# EAGLE schematic bms_108_Cell (EAGLE 6.2), part 1 of 2

## Sheet 1 of 9
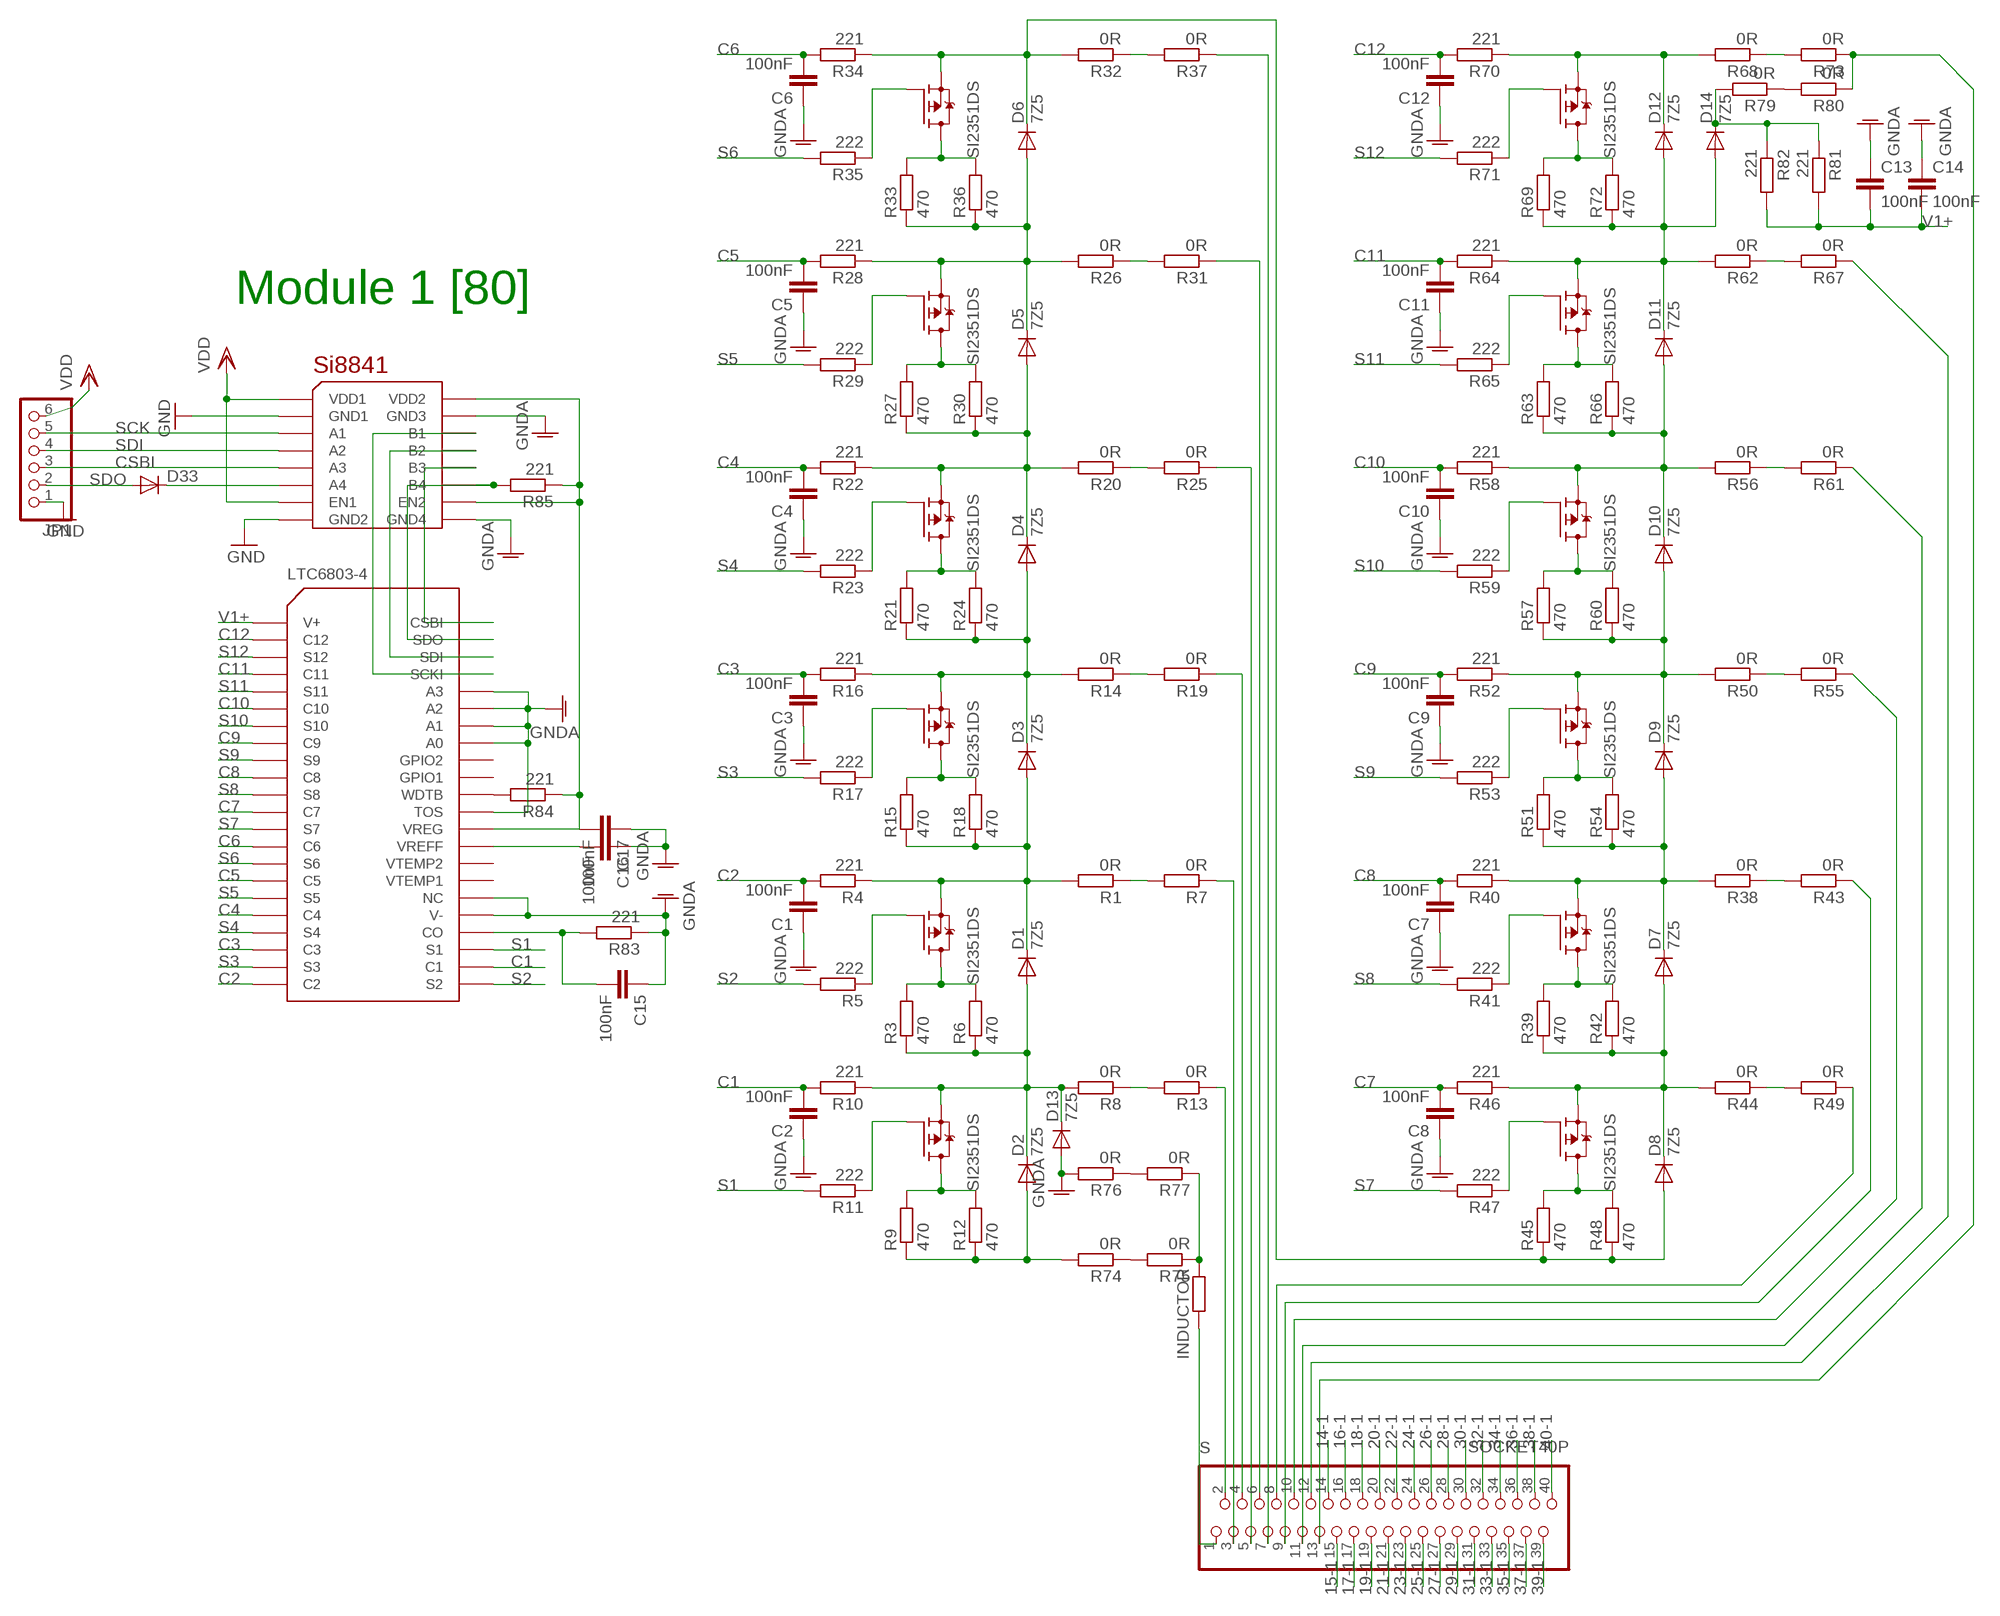
[diagram p0: schematic, sheet 1]

### Parts
C1  100nF  C-EUC0805K  [C0805K]
C2  100nF  C-EUC0805K  [C0805K]
C3  100nF  C-EUC0805K  [C0805K]
C4  100nF  C-EUC0805K  [C0805K]
C5  100nF  C-EUC0805K  [C0805K]
C6  100nF  C-EUC0805K  [C0805K]
C7  100nF  C-EUC0805K  [C0805K]
C8  100nF  C-EUC0805K  [C0805K]
C9  100nF  C-EUC0805K  [C0805K]
C10  100nF  C-EUC0805K  [C0805K]
C11  100nF  C-EUC0805K  [C0805K]
C12  100nF  C-EUC0805K  [C0805K]
C13  100nF  C-EUC0805K  [C0805K]
C14  100nF  C-EUC0805K  [C0805K]
C15  100nF  C-EUC0805K  [C0805K]
C16  100nF  C-EUC0805K  [C0805K]
C17  100nF  C-EUC0805K  [C0805K]
D1  7Z5  DIODE-SMB  [SMB]
D2  7Z5  DIODE-SMB  [SMB]
D3  7Z5  DIODE-SMB  [SMB]
D4  7Z5  DIODE-SMB  [SMB]
D5  7Z5  DIODE-SMB  [SMB]
D6  7Z5  DIODE-SMB  [SMB]
D7  7Z5  DIODE-SMB  [SMB]
D8  7Z5  DIODE-SMB  [SMB]
D9  7Z5  DIODE-SMB  [SMB]
D10  7Z5  DIODE-SMB  [SMB]
D11  7Z5  DIODE-SMB  [SMB]
D12  7Z5  DIODE-SMB  [SMB]
D13  7Z5  DIODE-SMB  [SMB]
D14  7Z5  DIODE-SMB  [SMB]
D33  DIODE-SOD123  [SOD123]
JP1  PINHD-1X6  [1X06]
R1  0R  R-EU_M1206  [M1206]
R3  470  R-EU_R6332  [R6332]
R4  221  R-EU_R0805  [R0805]
R5  222  R-EU_R0805  [R0805]
R6  470  R-EU_R6332  [R6332]
R7  0R  R-EU_M1206  [M1206]
R8  0R  R-EU_M1206  [M1206]
R9  470  R-EU_R6332  [R6332]
R10  221  R-EU_R0805  [R0805]
R11  222  R-EU_R0805  [R0805]
R12  470  R-EU_R6332  [R6332]
R13  0R  R-EU_M1206  [M1206]
R14  0R  R-EU_M1206  [M1206]
R15  470  R-EU_R6332  [R6332]
R16  221  R-EU_R0805  [R0805]
R17  222  R-EU_R0805  [R0805]
R18  470  R-EU_R6332  [R6332]
R19  0R  R-EU_M1206  [M1206]
R20  0R  R-EU_M1206  [M1206]
R21  470  R-EU_R6332  [R6332]
R22  221  R-EU_R0805  [R0805]
R23  222  R-EU_R0805  [R0805]
R24  470  R-EU_R6332  [R6332]
R25  0R  R-EU_M1206  [M1206]
R26  0R  R-EU_M1206  [M1206]
R27  470  R-EU_R6332  [R6332]
R28  221  R-EU_R0805  [R0805]
R29  222  R-EU_R0805  [R0805]
R30  470  R-EU_R6332  [R6332]
R31  0R  R-EU_M1206  [M1206]
R32  0R  R-EU_M1206  [M1206]
R33  470  R-EU_R6332  [R6332]
R34  221  R-EU_R0805  [R0805]
R35  222  R-EU_R0805  [R0805]
R36  470  R-EU_R6332  [R6332]
R37  0R  R-EU_M1206  [M1206]
R38  0R  R-EU_M1206  [M1206]
R39  470  R-EU_R6332  [R6332]
R40  221  R-EU_R0805  [R0805]
R41  222  R-EU_R0805  [R0805]
R42  470  R-EU_R6332  [R6332]
R43  0R  R-EU_M1206  [M1206]
R44  0R  R-EU_M1206  [M1206]
R45  470  R-EU_R6332  [R6332]
R46  221  R-EU_R0805  [R0805]
R47  222  R-EU_R0805  [R0805]
R48  470  R-EU_R6332  [R6332]
R49  0R  R-EU_M1206  [M1206]
R50  0R  R-EU_M1206  [M1206]
R51  470  R-EU_R6332  [R6332]
R52  221  R-EU_R0805  [R0805]
R53  222  R-EU_R0805  [R0805]
R54  470  R-EU_R6332  [R6332]
R55  0R  R-EU_M1206  [M1206]
R56  0R  R-EU_M1206  [M1206]
R57  470  R-EU_R6332  [R6332]
R58  221  R-EU_R0805  [R0805]
R59  222  R-EU_R0805  [R0805]
R60  470  R-EU_R6332  [R6332]
R61  0R  R-EU_M1206  [M1206]
R62  0R  R-EU_M1206  [M1206]
R63  470  R-EU_R6332  [R6332]
R64  221  R-EU_R0805  [R0805]
R65  222  R-EU_R0805  [R0805]
R66  470  R-EU_R6332  [R6332]
R67  0R  R-EU_M1206  [M1206]
R68  0R  R-EU_M1206  [M1206]
R69  470  R-EU_R6332  [R6332]
R70  221  R-EU_R0805  [R0805]
R71  222  R-EU_R0805  [R0805]
R72  470  R-EU_R6332  [R6332]
R73  0R  R-EU_M1206  [M1206]
R74  0R  R-EU_M1206  [M1206]
R75  0R  R-EU_M1206  [M1206]
R76  0R  R-EU_M1206  [M1206]
R77  0R  R-EU_M1206  [M1206]
R79  0R  R-EU_M1206  [M1206]
R80  0R  R-EU_M1206  [M1206]
R81  221  R-EU_R0805  [R0805]
R82  221  R-EU_R0805  [R0805]
R83  221  R-EU_R0805  [R0805]
R84  221  R-EU_R0805  [R0805]
R85  221  R-EU_R0805  [R0805]
S  SOCKET40P  [40PIN]
U$1  LTC6803-4  [SSOP44]
U$2  SI8841  [SO16]
U$3  SI2351DS  [SOT23]
U$4  SI2351DS  [SOT23]
U$5  SI2351DS  [SOT23]
U$6  SI2351DS  [SOT23]
U$7  SI2351DS  [SOT23]
U$8  SI2351DS  [SOT23]
U$9  SI2351DS  [SOT23]
U$10  SI2351DS  [SOT23]
U$11  SI2351DS  [SOT23]
U$12  SI2351DS  [SOT23]
U$13  SI2351DS  [SOT23]
U$14  SI2351DS  [SOT23]
U$15  INDUCTOR  [L2012C]

### Nets
14-1: S.14 ; also sheet 2
15-1: S.15 ; also sheet 2
16-1: S.16 ; also sheet 2
17-1: S.17 ; also sheet 2
18-1: S.18 ; also sheet 2
19-1: S.19 ; also sheet 2
20-1: S.20 ; also sheet 2
21-1: S.21 ; also sheet 2
22-1: S.22 ; also sheet 2
23-1: S.23 ; also sheet 2
24-1: S.24 ; also sheet 2
25-1: S.25 ; also sheet 2
26-1: S.26 ; also sheet 2
27-1: S.27
28-1: S.28 ; also sheet 3
29-1: S.29 ; also sheet 3
30-1: S.30 ; also sheet 3
31-1: S.31 ; also sheet 3
32-1: S.32 ; also sheet 3
33-1: S.33 ; also sheet 3
34-1: S.34 ; also sheet 3
35-1: S.35 ; also sheet 3
36-1: S.36 ; also sheet 3
37-1: S.37 ; also sheet 3
38-1: S.38 ; also sheet 3
39-1: S.39 ; also sheet 3
40-1: S.40 ; also sheet 3
C1: C2.2 R10.2 U$1.24(C1)
C2: C1.2 R4.2 U$1.P$22(C2)
C3: C3.2 R16.2 U$1.P$20(C3)
C4: C4.2 R22.2 U$1.P$18(C4)
C5: C5.2 R28.2 U$1.P$16(C5)
C6: C6.2 R34.2 U$1.P$14(C6)
C7: C8.2 R46.2 U$1.P$12(C7)
C8: C7.2 R40.2 U$1.P$10(C8)
C9: C9.2 R52.2 U$1.P$8(C9)
C10: C10.2 R58.2 U$1.P$6(C10)
C11: C11.2 R64.2 U$1.P$4(C11)
C12: C12.2 R70.2 U$1.P$2(C12)
CSBI: JP1.3 U$2.5(A3) ; also sheet 2,3,4,5,6,7,8,9
GND: JP1.1 U$2.2(GND1) U$2.8(GND2) ; also sheet 2,3,4,5,6,7,8,9
GNDA: C1.1 C2.1 C3.1 C4.1 C5.1 C6.1 C7.1 C8.1 C9.1 C10.1 C11.1 C12.1 C13.1 C14.1 C15.1 C16.1 C17.1 D13.A R76.2 R83.1 U$1.27(V-) U$1.28(NC) U$1.33(TOS) U$1.37(A0) U$1.38(A1) U$1.39(A2) U$1.40(A3) U$2.9(GND4) U$2.15(GND3)
N$1: R5.1 U$3.1(G)
N$2: R74.1 R75.2
N$3: R3.2 R6.2 U$3.3(D)
N$4: D1.A D2.C D13.C R3.1 R6.1 R8.2 R10.1 U$4.2(S)
N$5: R41.1 U$9.1(G)
N$6: R29.1 U$7.1(G)
N$7: R23.1 U$6.1(G)
N$8: R21.2 R24.2 U$6.3(D)
N$9: R1.1 R7.2
N$10: R11.1 U$4.1(G)
N$11: R9.2 R12.2 U$4.3(D)
N$12: R76.1 R77.2
N$13: D3.C D4.A R14.2 R16.1 R21.1 R24.1 U$5.2(S)
N$14: R8.1 R13.2
N$15: R27.2 R30.2 U$7.3(D)
N$16: R17.1 U$5.1(G)
N$17: R15.2 R18.2 U$5.3(D)
N$18: D1.C D3.A R1.2 R4.1 R15.1 R18.1 U$3.2(S)
N$19: R20.1 R25.2
N$20: R14.1 R19.2
N$21: D4.C D5.A R20.2 R22.1 R27.1 R30.1 U$6.2(S)
N$22: R26.1 R31.2
N$23: R75.1 R77.1 U$15.1
N$24: R35.1 U$8.1(G)
N$25: R33.2 R36.2 U$8.3(D)
N$26: D5.C D6.A R26.2 R28.1 R33.1 R36.1 U$7.2(S)
N$27: R32.1 R37.2
N$28: R39.2 R42.2 U$9.3(D)
N$29: D7.A D8.C R39.1 R42.1 R44.2 R46.1 U$10.2(S)
N$30: R38.1 R43.2
N$31: R47.1 U$10.1(G)
N$32: R45.2 R48.2 U$10.3(D)
N$33: D6.C D8.A R32.2 R34.1 R45.1 R48.1 U$8.2(S)
N$34: R44.1 R49.2
N$35: R53.1 U$11.1(G)
N$36: R51.2 R54.2 U$11.3(D)
N$37: D7.C D9.A R38.2 R40.1 R51.1 R54.1 U$9.2(S)
N$38: R50.1 R55.2
N$39: D2.A R9.1 R12.1 R74.2
N$40: R59.1 U$12.1(G)
N$41: R57.2 R60.2 U$12.3(D)
N$42: D9.C D10.A R50.2 R52.1 R57.1 R60.1 U$11.2(S)
N$43: R56.1 R61.2
N$44: R65.1 U$13.1(G)
N$45: R63.2 R66.2 U$13.3(D)
N$46: D10.C D11.A R56.2 R58.1 R63.1 R66.1 U$12.2(S)
N$47: R62.1 R67.2
N$48: D12.C R68.2 R70.1 U$14.2(S)
N$49: R71.1 U$14.1(G)
N$50: R69.2 R72.2 U$14.3(D)
N$51: D11.C D12.A D14.A R62.2 R64.1 R69.1 R72.1 U$13.2(S)
N$52: R68.1 R73.2
N$53: R85.2 U$1.43(SDO) U$2.11(B4)
N$55: R79.1 R80.2
N$56: C15.2 R83.2 U$1.26(CO)
N$57: D14.C R79.2 R81.1 R82.1
N$58: R73.1 R80.1 S.13
N$59: C16.2 U$1.31(VREFF)
N$60: C17.2 R84.1 R85.1 U$1.32(VREG) U$2.10(EN2) U$2.16(VDD2)
N$61: U$1.41(SCKI) U$2.14(B1)
N$62: R84.2 U$1.34(WDTB)
N$63: U$1.44(CSBI) U$2.12(B3)
N$64: U$1.42(SDI) U$2.13(B2)
N$65: S.1 U$15.2
N$66: R13.1 S.2
N$67: R7.1 S.3
N$68: R19.1 S.4
N$69: R25.1 S.5
N$70: R31.1 S.6
N$71: R37.1 S.7
N$72: R49.1 S.8
N$73: R43.1 S.9
N$74: R55.1 S.10
N$75: R61.1 S.11
N$76: R67.1 S.12
N$159: D33.C U$2.6(A4)
S1: R11.2 U$1.25(S1)
S2: R5.2 U$1.23(S2)
S3: R17.2 U$1.P$21(S3)
S4: R23.2 U$1.P$19(S4)
S5: R29.2 U$1.P$17(S5)
S6: R35.2 U$1.P$15(S6)
S7: R47.2 U$1.P$13(S7)
S8: R41.2 U$1.P$11(S8)
S9: R53.2 U$1.P$9(S9)
S10: R59.2 U$1.P$7(S10)
S11: R65.2 U$1.P$5(S11)
S12: R71.2 U$1.P$3(S12)
SCK: JP1.5 U$2.3(A1) ; also sheet 2,3,4,5,6,7,8,9
SDI: JP1.4 U$2.4(A2) ; also sheet 2,3,4,5,6,7,8,9
SDO: D33.A JP1.2 ; also sheet 2,3,4,5,6,7,8,9
V1+: C13.2 C14.2 R81.2 R82.2 U$1.P$1(V+)
VDD: JP1.6 U$2.1(VDD1) U$2.7(EN1) ; also sheet 2,3,4,5,6,7,8,9
Unconnected: U$1.29(VTEMP1) U$1.30(VTEMP2) U$1.35(GPIO1) U$1.36(GPIO2)

### Notes on the sheet
- Module 1 [80]

## Sheet 2 of 9
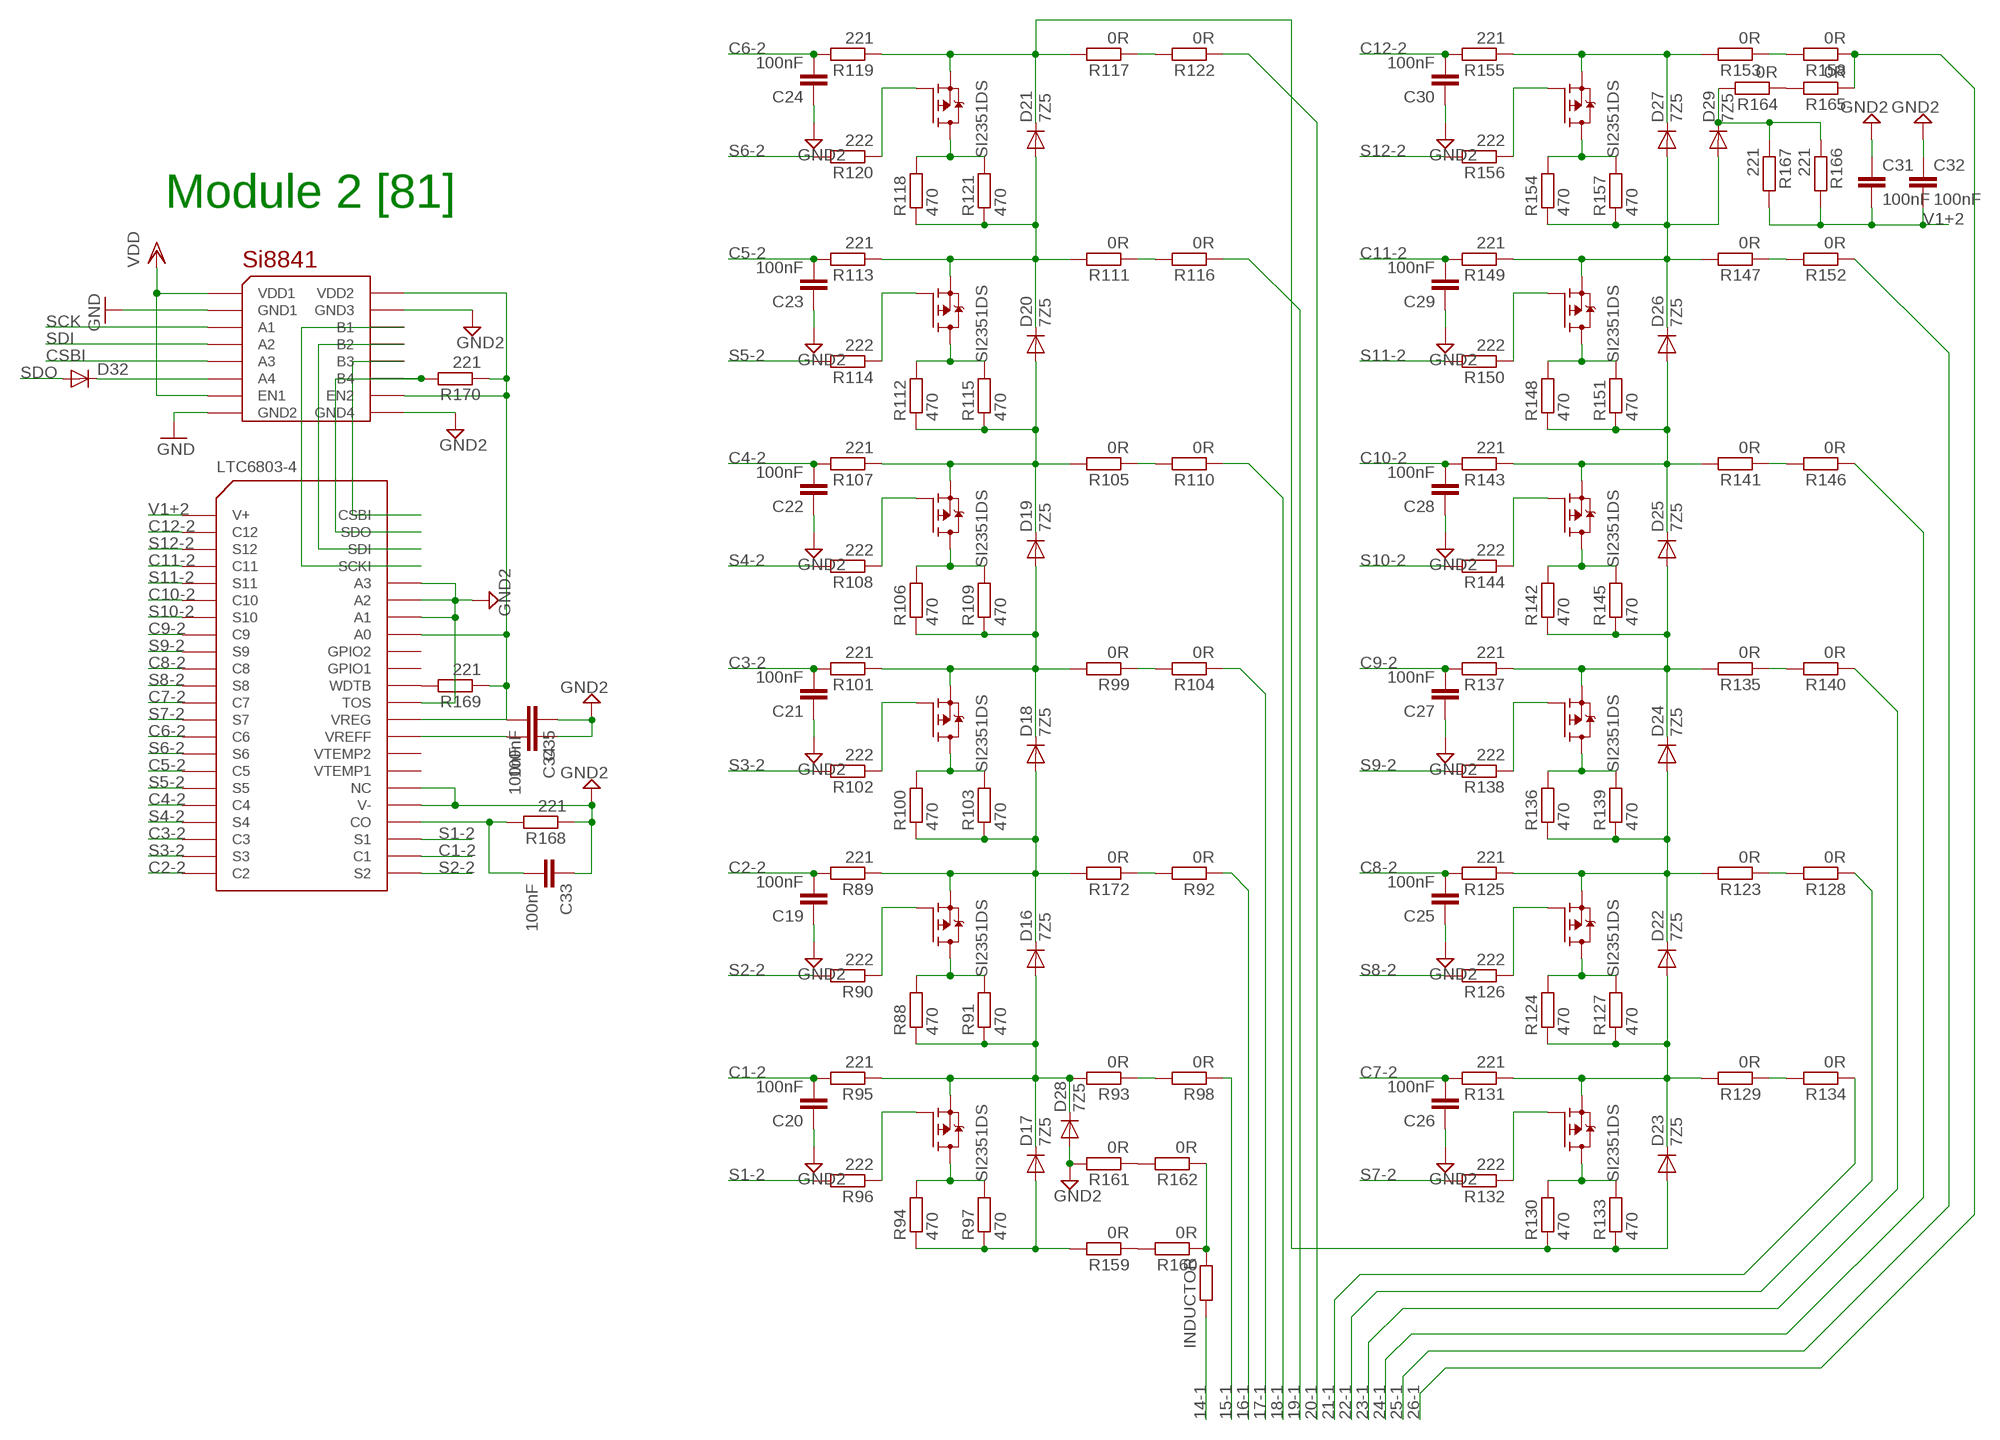
[diagram p1: schematic, sheet 2]

### Parts
C19  100nF  C-EUC0805K  [C0805K]
C20  100nF  C-EUC0805K  [C0805K]
C21  100nF  C-EUC0805K  [C0805K]
C22  100nF  C-EUC0805K  [C0805K]
C23  100nF  C-EUC0805K  [C0805K]
C24  100nF  C-EUC0805K  [C0805K]
C25  100nF  C-EUC0805K  [C0805K]
C26  100nF  C-EUC0805K  [C0805K]
C27  100nF  C-EUC0805K  [C0805K]
C28  100nF  C-EUC0805K  [C0805K]
C29  100nF  C-EUC0805K  [C0805K]
C30  100nF  C-EUC0805K  [C0805K]
C31  100nF  C-EUC0805K  [C0805K]
C32  100nF  C-EUC0805K  [C0805K]
C33  100nF  C-EUC0805K  [C0805K]
C34  100nF  C-EUC0805K  [C0805K]
C35  100nF  C-EUC0805K  [C0805K]
D16  7Z5  DIODE-SMB  [SMB]
D17  7Z5  DIODE-SMB  [SMB]
D18  7Z5  DIODE-SMB  [SMB]
D19  7Z5  DIODE-SMB  [SMB]
D20  7Z5  DIODE-SMB  [SMB]
D21  7Z5  DIODE-SMB  [SMB]
D22  7Z5  DIODE-SMB  [SMB]
D23  7Z5  DIODE-SMB  [SMB]
D24  7Z5  DIODE-SMB  [SMB]
D25  7Z5  DIODE-SMB  [SMB]
D26  7Z5  DIODE-SMB  [SMB]
D27  7Z5  DIODE-SMB  [SMB]
D28  7Z5  DIODE-SMB  [SMB]
D29  7Z5  DIODE-SMB  [SMB]
D32  DIODE-SOD123  [SOD123]
R88  470  R-EU_R6332  [R6332]
R89  221  R-EU_R0805  [R0805]
R90  222  R-EU_R0805  [R0805]
R91  470  R-EU_R6332  [R6332]
R92  0R  R-EU_M1206  [M1206]
R93  0R  R-EU_M1206  [M1206]
R94  470  R-EU_R6332  [R6332]
R95  221  R-EU_R0805  [R0805]
R96  222  R-EU_R0805  [R0805]
R97  470  R-EU_R6332  [R6332]
R98  0R  R-EU_M1206  [M1206]
R99  0R  R-EU_M1206  [M1206]
R100  470  R-EU_R6332  [R6332]
R101  221  R-EU_R0805  [R0805]
R102  222  R-EU_R0805  [R0805]
R103  470  R-EU_R6332  [R6332]
R104  0R  R-EU_M1206  [M1206]
R105  0R  R-EU_M1206  [M1206]
R106  470  R-EU_R6332  [R6332]
R107  221  R-EU_R0805  [R0805]
R108  222  R-EU_R0805  [R0805]
R109  470  R-EU_R6332  [R6332]
R110  0R  R-EU_M1206  [M1206]
R111  0R  R-EU_M1206  [M1206]
R112  470  R-EU_R6332  [R6332]
R113  221  R-EU_R0805  [R0805]
R114  222  R-EU_R0805  [R0805]
R115  470  R-EU_R6332  [R6332]
R116  0R  R-EU_M1206  [M1206]
R117  0R  R-EU_M1206  [M1206]
R118  470  R-EU_R6332  [R6332]
R119  221  R-EU_R0805  [R0805]
R120  222  R-EU_R0805  [R0805]
R121  470  R-EU_R6332  [R6332]
R122  0R  R-EU_M1206  [M1206]
R123  0R  R-EU_M1206  [M1206]
R124  470  R-EU_R6332  [R6332]
R125  221  R-EU_R0805  [R0805]
R126  222  R-EU_R0805  [R0805]
R127  470  R-EU_R6332  [R6332]
R128  0R  R-EU_M1206  [M1206]
R129  0R  R-EU_M1206  [M1206]
R130  470  R-EU_R6332  [R6332]
R131  221  R-EU_R0805  [R0805]
R132  222  R-EU_R0805  [R0805]
R133  470  R-EU_R6332  [R6332]
R134  0R  R-EU_M1206  [M1206]
R135  0R  R-EU_M1206  [M1206]
R136  470  R-EU_R6332  [R6332]
R137  221  R-EU_R0805  [R0805]
R138  222  R-EU_R0805  [R0805]
R139  470  R-EU_R6332  [R6332]
R140  0R  R-EU_M1206  [M1206]
R141  0R  R-EU_M1206  [M1206]
R142  470  R-EU_R6332  [R6332]
R143  221  R-EU_R0805  [R0805]
R144  222  R-EU_R0805  [R0805]
R145  470  R-EU_R6332  [R6332]
R146  0R  R-EU_M1206  [M1206]
R147  0R  R-EU_M1206  [M1206]
R148  470  R-EU_R6332  [R6332]
R149  221  R-EU_R0805  [R0805]
R150  222  R-EU_R0805  [R0805]
R151  470  R-EU_R6332  [R6332]
R152  0R  R-EU_M1206  [M1206]
R153  0R  R-EU_M1206  [M1206]
R154  470  R-EU_R6332  [R6332]
R155  221  R-EU_R0805  [R0805]
R156  222  R-EU_R0805  [R0805]
R157  470  R-EU_R6332  [R6332]
R158  0R  R-EU_M1206  [M1206]
R159  0R  R-EU_M1206  [M1206]
R160  0R  R-EU_M1206  [M1206]
R161  0R  R-EU_M1206  [M1206]
R162  0R  R-EU_M1206  [M1206]
R164  0R  R-EU_M1206  [M1206]
R165  0R  R-EU_M1206  [M1206]
R166  221  R-EU_R0805  [R0805]
R167  221  R-EU_R0805  [R0805]
R168  221  R-EU_R0805  [R0805]
R169  221  R-EU_R0805  [R0805]
R170  221  R-EU_R0805  [R0805]
R172  0R  R-EU_M1206  [M1206]
U$16  LTC6803-4  [SSOP44]
U$17  SI8841  [SO16]
U$18  SI2351DS  [SOT23]
U$19  SI2351DS  [SOT23]
U$20  SI2351DS  [SOT23]
U$21  SI2351DS  [SOT23]
U$22  SI2351DS  [SOT23]
U$23  SI2351DS  [SOT23]
U$24  SI2351DS  [SOT23]
U$25  SI2351DS  [SOT23]
U$26  SI2351DS  [SOT23]
U$27  SI2351DS  [SOT23]
U$28  SI2351DS  [SOT23]
U$29  SI2351DS  [SOT23]
U$30  INDUCTOR  [L2012C]

### Nets
14-1: U$30.2 ; also sheet 1
15-1: R98.1 ; also sheet 1
16-1: R92.1 ; also sheet 1
17-1: R104.1 ; also sheet 1
18-1: R110.1 ; also sheet 1
19-1: R116.1 ; also sheet 1
20-1: R122.1 ; also sheet 1
21-1: R134.1 ; also sheet 1
22-1: R128.1 ; also sheet 1
23-1: R140.1 ; also sheet 1
24-1: R146.1 ; also sheet 1
25-1: R152.1 ; also sheet 1
26-1: R158.1 R165.1 ; also sheet 1
C1-2: C20.2 R95.2 U$16.24(C1)
C2-2: C19.2 R89.2 U$16.P$22(C2)
C3-2: C21.2 R101.2 U$16.P$20(C3)
C4-2: C22.2 R107.2 U$16.P$18(C4)
C5-2: C23.2 R113.2 U$16.P$16(C5)
C6-2: C24.2 R119.2 U$16.P$14(C6)
C7-2: C26.2 R131.2 U$16.P$12(C7)
C8-2: C25.2 R125.2 U$16.P$10(C8)
C9-2: C27.2 R137.2 U$16.P$8(C9)
C10-2: C28.2 R143.2 U$16.P$6(C10)
C11-2: C29.2 R149.2 U$16.P$4(C11)
C12-2: C30.2 R155.2 U$16.P$2(C12)
CSBI: U$17.5(A3) ; also sheet 1,3,4,5,6,7,8,9
GND: U$17.2(GND1) U$17.8(GND2) ; also sheet 1,3,4,5,6,7,8,9
GND2: C19.1 C20.1 C21.1 C22.1 C23.1 C24.1 C25.1 C26.1 C27.1 C28.1 C29.1 C30.1 C31.1 C32.1 C33.1 C34.1 C35.1 D28.A R161.2 R168.1 U$16.27(V-) U$16.28(NC) U$16.33(TOS) U$16.38(A1) U$16.39(A2) U$16.40(A3) U$17.9(GND4) U$17.15(GND3)
N$77: R90.1 U$18.1(G)
N$78: R88.2 R91.2 U$18.3(D)
N$79: D16.A D17.C D28.C R88.1 R91.1 R93.2 R95.1 U$19.2(S)
N$80: R92.2 R172.1
N$81: R96.1 U$19.1(G)
N$82: R94.2 R97.2 U$19.3(D)
N$83: R93.1 R98.2
N$84: R102.1 U$20.1(G)
N$85: R100.2 R103.2 U$20.3(D)
N$86: D16.C D18.A R89.1 R100.1 R103.1 R172.2 U$18.2(S)
N$87: R99.1 R104.2
N$88: R108.1 U$21.1(G)
N$89: R106.2 R109.2 U$21.3(D)
N$90: D18.C D19.A R99.2 R101.1 R106.1 R109.1 U$20.2(S)
N$91: R105.1 R110.2
N$92: R114.1 U$22.1(G)
N$93: R112.2 R115.2 U$22.3(D)
N$94: D19.C D20.A R105.2 R107.1 R112.1 R115.1 U$21.2(S)
N$95: R111.1 R116.2
N$96: R120.1 U$23.1(G)
N$97: R118.2 R121.2 U$23.3(D)
N$98: D20.C D21.A R111.2 R113.1 R118.1 R121.1 U$22.2(S)
N$99: R117.1 R122.2
N$100: R126.1 U$24.1(G)
N$101: R124.2 R127.2 U$24.3(D)
N$102: D22.A D23.C R124.1 R127.1 R129.2 R131.1 U$25.2(S)
N$103: R123.1 R128.2
N$104: R132.1 U$25.1(G)
N$105: R130.2 R133.2 U$25.3(D)
N$106: D21.C D23.A R117.2 R119.1 R130.1 R133.1 U$23.2(S)
N$107: R129.1 R134.2
N$108: R138.1 U$26.1(G)
N$109: R136.2 R139.2 U$26.3(D)
N$110: D22.C D24.A R123.2 R125.1 R136.1 R139.1 U$24.2(S)
N$111: R135.1 R140.2
N$112: R144.1 U$27.1(G)
N$113: R142.2 R145.2 U$27.3(D)
N$114: D24.C D25.A R135.2 R137.1 R142.1 R145.1 U$26.2(S)
N$115: R141.1 R146.2
N$116: R150.1 U$28.1(G)
N$117: R148.2 R151.2 U$28.3(D)
N$118: D25.C D26.A R141.2 R143.1 R148.1 R151.1 U$27.2(S)
N$119: R147.1 R152.2
N$120: D27.C R153.2 R155.1 U$29.2(S)
N$121: R156.1 U$29.1(G)
N$122: R154.2 R157.2 U$29.3(D)
N$123: D26.C D27.A D29.A R147.2 R149.1 R154.1 R157.1 U$28.2(S)
N$124: R153.1 R158.2
N$125: R159.1 R160.2
N$126: R160.1 R162.1 U$30.1
N$127: D17.A R94.1 R97.1 R159.2
N$128: R161.1 R162.2
N$130: R164.1 R165.2
N$131: D29.C R164.2 R166.1 R167.1
N$133: C33.2 R168.2 U$16.26(CO)
N$134: C34.2 U$16.31(VREFF)
N$135: C35.2 R169.1 R170.1 U$16.32(VREG) U$16.37(A0) U$17.10(EN2) U$17.16(VDD2)
N$136: R169.2 U$16.34(WDTB)
N$137: R170.2 U$16.43(SDO) U$17.11(B4)
N$138: U$16.44(CSBI) U$17.12(B3)
N$139: U$16.42(SDI) U$17.13(B2)
N$140: U$16.41(SCKI) U$17.14(B1)
N$153: D32.C U$17.6(A4)
S1-2: R96.2 U$16.25(S1)
S2-2: R90.2 U$16.23(S2)
S3-2: R102.2 U$16.P$21(S3)
S4-2: R108.2 U$16.P$19(S4)
S5-2: R114.2 U$16.P$17(S5)
S6-2: R120.2 U$16.P$15(S6)
S7-2: R132.2 U$16.P$13(S7)
S8-2: R126.2 U$16.P$11(S8)
S9-2: R138.2 U$16.P$9(S9)
S10-2: R144.2 U$16.P$7(S10)
S11-2: R150.2 U$16.P$5(S11)
S12-2: R156.2 U$16.P$3(S12)
SCK: U$17.3(A1) ; also sheet 1,3,4,5,6,7,8,9
SDI: U$17.4(A2) ; also sheet 1,3,4,5,6,7,8,9
SDO: D32.A ; also sheet 1,3,4,5,6,7,8,9
V1+2: C31.2 C32.2 R166.2 R167.2 U$16.P$1(V+)
VDD: U$17.1(VDD1) U$17.7(EN1) ; also sheet 1,3,4,5,6,7,8,9
Unconnected: U$16.29(VTEMP1) U$16.30(VTEMP2) U$16.35(GPIO1) U$16.36(GPIO2)

### Notes on the sheet
- Module 2 [81]

## Sheet 3 of 9
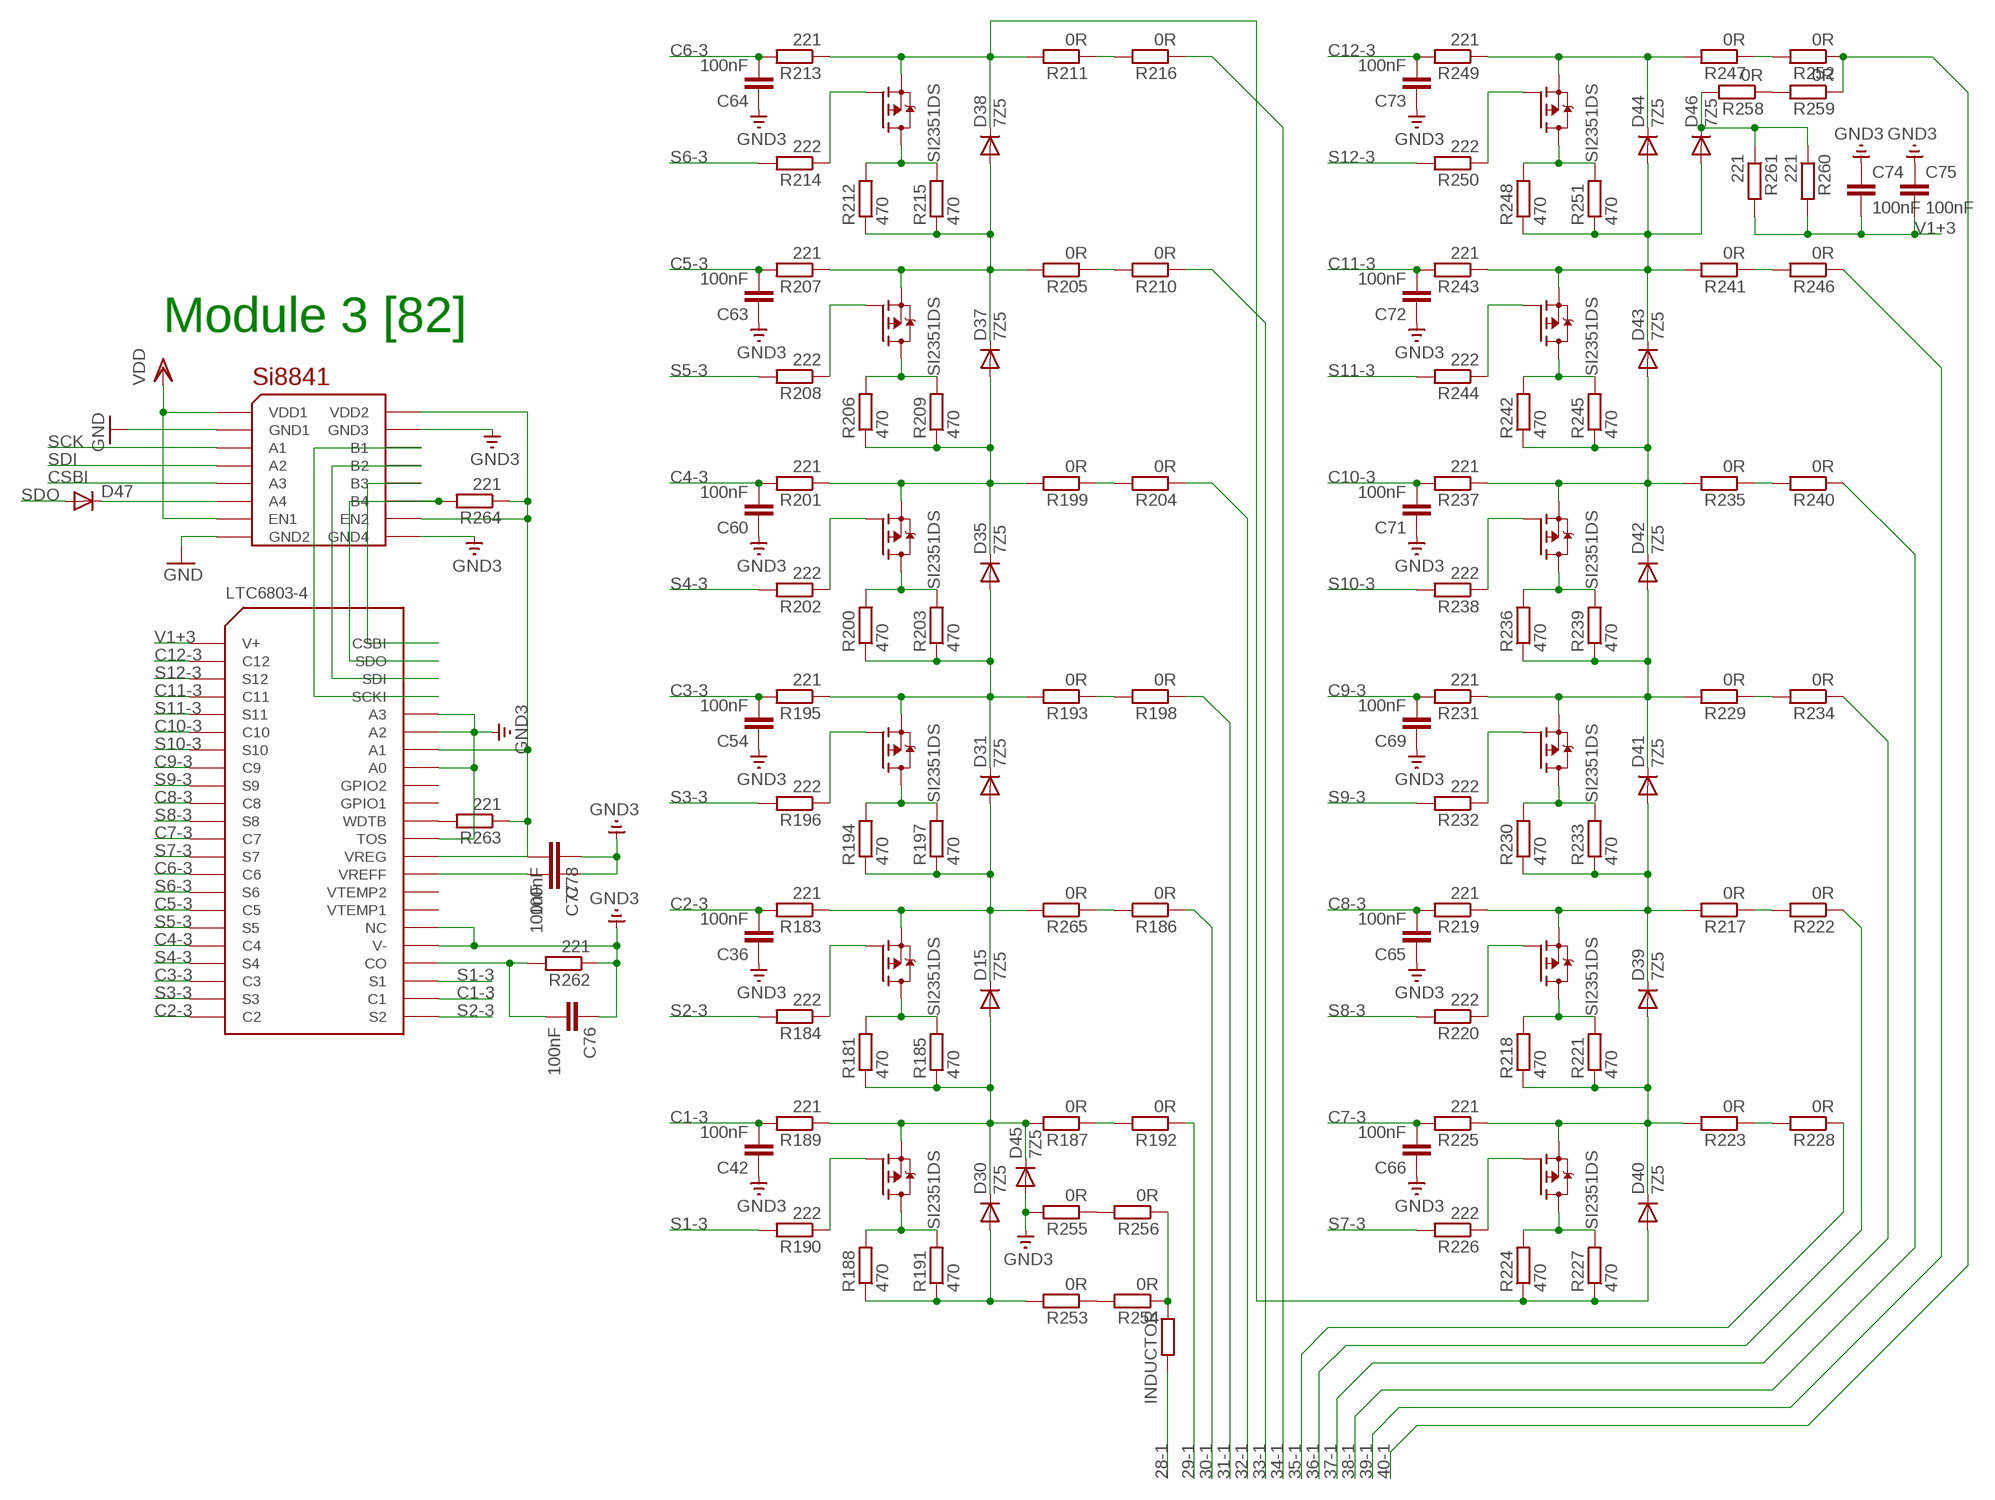
[diagram p2: schematic, sheet 3]

### Parts
C36  100nF  C-EUC0805K  [C0805K]
C42  100nF  C-EUC0805K  [C0805K]
C54  100nF  C-EUC0805K  [C0805K]
C60  100nF  C-EUC0805K  [C0805K]
C63  100nF  C-EUC0805K  [C0805K]
C64  100nF  C-EUC0805K  [C0805K]
C65  100nF  C-EUC0805K  [C0805K]
C66  100nF  C-EUC0805K  [C0805K]
C69  100nF  C-EUC0805K  [C0805K]
C71  100nF  C-EUC0805K  [C0805K]
C72  100nF  C-EUC0805K  [C0805K]
C73  100nF  C-EUC0805K  [C0805K]
C74  100nF  C-EUC0805K  [C0805K]
C75  100nF  C-EUC0805K  [C0805K]
C76  100nF  C-EUC0805K  [C0805K]
C77  100nF  C-EUC0805K  [C0805K]
C78  100nF  C-EUC0805K  [C0805K]
D15  7Z5  DIODE-SMB  [SMB]
D30  7Z5  DIODE-SMB  [SMB]
D31  7Z5  DIODE-SMB  [SMB]
D35  7Z5  DIODE-SMB  [SMB]
D37  7Z5  DIODE-SMB  [SMB]
D38  7Z5  DIODE-SMB  [SMB]
D39  7Z5  DIODE-SMB  [SMB]
D40  7Z5  DIODE-SMB  [SMB]
D41  7Z5  DIODE-SMB  [SMB]
D42  7Z5  DIODE-SMB  [SMB]
D43  7Z5  DIODE-SMB  [SMB]
D44  7Z5  DIODE-SMB  [SMB]
D45  7Z5  DIODE-SMB  [SMB]
D46  7Z5  DIODE-SMB  [SMB]
D47  DIODE-SOD123  [SOD123]
R181  470  R-EU_R6332  [R6332]
R183  221  R-EU_R0805  [R0805]
R184  222  R-EU_R0805  [R0805]
R185  470  R-EU_R6332  [R6332]
R186  0R  R-EU_M1206  [M1206]
R187  0R  R-EU_M1206  [M1206]
R188  470  R-EU_R6332  [R6332]
R189  221  R-EU_R0805  [R0805]
R190  222  R-EU_R0805  [R0805]
R191  470  R-EU_R6332  [R6332]
R192  0R  R-EU_M1206  [M1206]
R193  0R  R-EU_M1206  [M1206]
R194  470  R-EU_R6332  [R6332]
R195  221  R-EU_R0805  [R0805]
R196  222  R-EU_R0805  [R0805]
R197  470  R-EU_R6332  [R6332]
R198  0R  R-EU_M1206  [M1206]
R199  0R  R-EU_M1206  [M1206]
R200  470  R-EU_R6332  [R6332]
R201  221  R-EU_R0805  [R0805]
R202  222  R-EU_R0805  [R0805]
R203  470  R-EU_R6332  [R6332]
R204  0R  R-EU_M1206  [M1206]
R205  0R  R-EU_M1206  [M1206]
R206  470  R-EU_R6332  [R6332]
R207  221  R-EU_R0805  [R0805]
R208  222  R-EU_R0805  [R0805]
R209  470  R-EU_R6332  [R6332]
R210  0R  R-EU_M1206  [M1206]
R211  0R  R-EU_M1206  [M1206]
R212  470  R-EU_R6332  [R6332]
R213  221  R-EU_R0805  [R0805]
R214  222  R-EU_R0805  [R0805]
R215  470  R-EU_R6332  [R6332]
R216  0R  R-EU_M1206  [M1206]
R217  0R  R-EU_M1206  [M1206]
R218  470  R-EU_R6332  [R6332]
R219  221  R-EU_R0805  [R0805]
R220  222  R-EU_R0805  [R0805]
R221  470  R-EU_R6332  [R6332]
R222  0R  R-EU_M1206  [M1206]
R223  0R  R-EU_M1206  [M1206]
R224  470  R-EU_R6332  [R6332]
R225  221  R-EU_R0805  [R0805]
R226  222  R-EU_R0805  [R0805]
R227  470  R-EU_R6332  [R6332]
R228  0R  R-EU_M1206  [M1206]
R229  0R  R-EU_M1206  [M1206]
R230  470  R-EU_R6332  [R6332]
R231  221  R-EU_R0805  [R0805]
R232  222  R-EU_R0805  [R0805]
R233  470  R-EU_R6332  [R6332]
R234  0R  R-EU_M1206  [M1206]
R235  0R  R-EU_M1206  [M1206]
R236  470  R-EU_R6332  [R6332]
R237  221  R-EU_R0805  [R0805]
R238  222  R-EU_R0805  [R0805]
R239  470  R-EU_R6332  [R6332]
R240  0R  R-EU_M1206  [M1206]
R241  0R  R-EU_M1206  [M1206]
R242  470  R-EU_R6332  [R6332]
R243  221  R-EU_R0805  [R0805]
R244  222  R-EU_R0805  [R0805]
R245  470  R-EU_R6332  [R6332]
R246  0R  R-EU_M1206  [M1206]
R247  0R  R-EU_M1206  [M1206]
R248  470  R-EU_R6332  [R6332]
R249  221  R-EU_R0805  [R0805]
R250  222  R-EU_R0805  [R0805]
R251  470  R-EU_R6332  [R6332]
R252  0R  R-EU_M1206  [M1206]
R253  0R  R-EU_M1206  [M1206]
R254  0R  R-EU_M1206  [M1206]
R255  0R  R-EU_M1206  [M1206]
R256  0R  R-EU_M1206  [M1206]
R258  0R  R-EU_M1206  [M1206]
R259  0R  R-EU_M1206  [M1206]
R260  221  R-EU_R0805  [R0805]
R261  221  R-EU_R0805  [R0805]
R262  221  R-EU_R0805  [R0805]
R263  221  R-EU_R0805  [R0805]
R264  221  R-EU_R0805  [R0805]
R265  0R  R-EU_M1206  [M1206]
U$34  LTC6803-4  [SSOP44]
U$35  SI8841  [SO16]
U$36  SI2351DS  [SOT23]
U$37  SI2351DS  [SOT23]
U$38  SI2351DS  [SOT23]
U$39  SI2351DS  [SOT23]
U$40  SI2351DS  [SOT23]
U$41  SI2351DS  [SOT23]
U$42  SI2351DS  [SOT23]
U$45  SI2351DS  [SOT23]
U$46  SI2351DS  [SOT23]
U$47  SI2351DS  [SOT23]
U$48  SI2351DS  [SOT23]
U$49  SI2351DS  [SOT23]
U$50  INDUCTOR  [L2012C]

### Nets
28-1: U$50.2 ; also sheet 1
29-1: R192.1 ; also sheet 1
30-1: R186.1 ; also sheet 1
31-1: R198.1 ; also sheet 1
32-1: R204.1 ; also sheet 1
33-1: R210.1 ; also sheet 1
34-1: R216.1 ; also sheet 1
35-1: R228.1 ; also sheet 1
36-1: R222.1 ; also sheet 1
37-1: R234.1 ; also sheet 1
38-1: R240.1 ; also sheet 1
39-1: R246.1 ; also sheet 1
40-1: R252.1 R259.1 ; also sheet 1
C1-3: C42.2 R189.2 U$34.24(C1)
C2-3: C36.2 R183.2 U$34.P$22(C2)
C3-3: C54.2 R195.2 U$34.P$20(C3)
C4-3: C60.2 R201.2 U$34.P$18(C4)
C5-3: C63.2 R207.2 U$34.P$16(C5)
C6-3: C64.2 R213.2 U$34.P$14(C6)
C7-3: C66.2 R225.2 U$34.P$12(C7)
C8-3: C65.2 R219.2 U$34.P$10(C8)
C9-3: C69.2 R231.2 U$34.P$8(C9)
C10-3: C71.2 R237.2 U$34.P$6(C10)
C11-3: C72.2 R243.2 U$34.P$4(C11)
C12-3: C73.2 R249.2 U$34.P$2(C12)
CSBI: U$35.5(A3) ; also sheet 1,2,4,5,6,7,8,9
GND: U$35.2(GND1) U$35.8(GND2) ; also sheet 1,2,4,5,6,7,8,9
GND3: C36.1 C42.1 C54.1 C60.1 C63.1 C64.1 C65.1 C66.1 C69.1 C71.1 C72.1 C73.1 C74.1 C75.1 C76.1 C77.1 C78.1 D45.A R255.2 R262.1 U$34.27(V-) U$34.28(NC) U$34.33(TOS) U$34.37(A0) U$34.39(A2) U$34.40(A3) U$35.9(GND4) U$35.15(GND3)
N$132: R184.1 U$36.1(G)
N$141: R181.2 R185.2 U$36.3(D)
N$142: D15.A D30.C D45.C R181.1 R185.1 R187.2 R189.1 U$37.2(S)
N$143: R186.2 R265.1
N$144: R190.1 U$37.1(G)
N$145: R188.2 R191.2 U$37.3(D)
N$146: R187.1 R192.2
N$147: R196.1 U$38.1(G)
N$148: R194.2 R197.2 U$38.3(D)
N$149: D15.C D31.A R183.1 R194.1 R197.1 R265.2 U$36.2(S)
N$150: R193.1 R198.2
N$151: R202.1 U$39.1(G)
N$152: R200.2 R203.2 U$39.3(D)
N$166: D31.C D35.A R193.2 R195.1 R200.1 R203.1 U$38.2(S)
N$168: R199.1 R204.2
N$171: R208.1 U$40.1(G)
N$172: R206.2 R209.2 U$40.3(D)
N$174: D35.C D37.A R199.2 R201.1 R206.1 R209.1 U$39.2(S)
N$176: R205.1 R210.2
N$178: R214.1 U$41.1(G)
N$179: R212.2 R215.2 U$41.3(D)
N$180: D37.C D38.A R205.2 R207.1 R212.1 R215.1 U$40.2(S)
N$181: R211.1 R216.2
N$182: R220.1 U$42.1(G)
N$183: R218.2 R221.2 U$42.3(D)
N$184: D39.A D40.C R218.1 R221.1 R223.2 R225.1 U$45.2(S)
N$185: R217.1 R222.2
N$186: R226.1 U$45.1(G)
N$187: R224.2 R227.2 U$45.3(D)
N$188: D38.C D40.A R211.2 R213.1 R224.1 R227.1 U$41.2(S)
N$189: R223.1 R228.2
N$190: R232.1 U$46.1(G)
N$191: R230.2 R233.2 U$46.3(D)
N$192: D39.C D41.A R217.2 R219.1 R230.1 R233.1 U$42.2(S)
N$193: R229.1 R234.2
N$194: R238.1 U$47.1(G)
N$195: R236.2 R239.2 U$47.3(D)
N$196: D41.C D42.A R229.2 R231.1 R236.1 R239.1 U$46.2(S)
N$197: R235.1 R240.2
N$198: R244.1 U$48.1(G)
N$199: R242.2 R245.2 U$48.3(D)
N$200: D42.C D43.A R235.2 R237.1 R242.1 R245.1 U$47.2(S)
N$201: R241.1 R246.2
N$202: D44.C R247.2 R249.1 U$49.2(S)
N$203: R250.1 U$49.1(G)
N$204: R248.2 R251.2 U$49.3(D)
N$205: D43.C D44.A D46.A R241.2 R243.1 R248.1 R251.1 U$48.2(S)
N$206: R247.1 R252.2
N$210: R253.1 R254.2
N$211: R254.1 R256.1 U$50.1
N$212: D30.A R188.1 R191.1 R253.2
N$213: R255.1 R256.2
N$215: R258.1 R259.2
N$216: D46.C R258.2 R260.1 R261.1
N$217: C76.2 R262.2 U$34.26(CO)
N$218: C77.2 U$34.31(VREFF)
N$219: C78.2 R263.1 R264.1 U$34.32(VREG) U$34.38(A1) U$35.10(EN2) U$35.16(VDD2)
N$220: R263.2 U$34.34(WDTB)
N$221: R264.2 U$34.43(SDO) U$35.11(B4)
N$222: U$34.44(CSBI) U$35.12(B3)
N$223: U$34.42(SDI) U$35.13(B2)
N$224: U$34.41(SCKI) U$35.14(B1)
N$225: D47.C U$35.6(A4)
S1-3: R190.2 U$34.25(S1)
S2-3: R184.2 U$34.23(S2)
S3-3: R196.2 U$34.P$21(S3)
S4-3: R202.2 U$34.P$19(S4)
S5-3: R208.2 U$34.P$17(S5)
S6-3: R214.2 U$34.P$15(S6)
S7-3: R226.2 U$34.P$13(S7)
S8-3: R220.2 U$34.P$11(S8)
S9-3: R232.2 U$34.P$9(S9)
S10-3: R238.2 U$34.P$7(S10)
S11-3: R244.2 U$34.P$5(S11)
S12-3: R250.2 U$34.P$3(S12)
SCK: U$35.3(A1) ; also sheet 1,2,4,5,6,7,8,9
SDI: U$35.4(A2) ; also sheet 1,2,4,5,6,7,8,9
SDO: D47.A ; also sheet 1,2,4,5,6,7,8,9
V1+3: C74.2 C75.2 R260.2 R261.2 U$34.P$1(V+)
VDD: U$35.1(VDD1) U$35.7(EN1) ; also sheet 1,2,4,5,6,7,8,9
Unconnected: U$34.29(VTEMP1) U$34.30(VTEMP2) U$34.35(GPIO1) U$34.36(GPIO2)

### Notes on the sheet
- Module 3 [82]

## Sheet 4 of 9
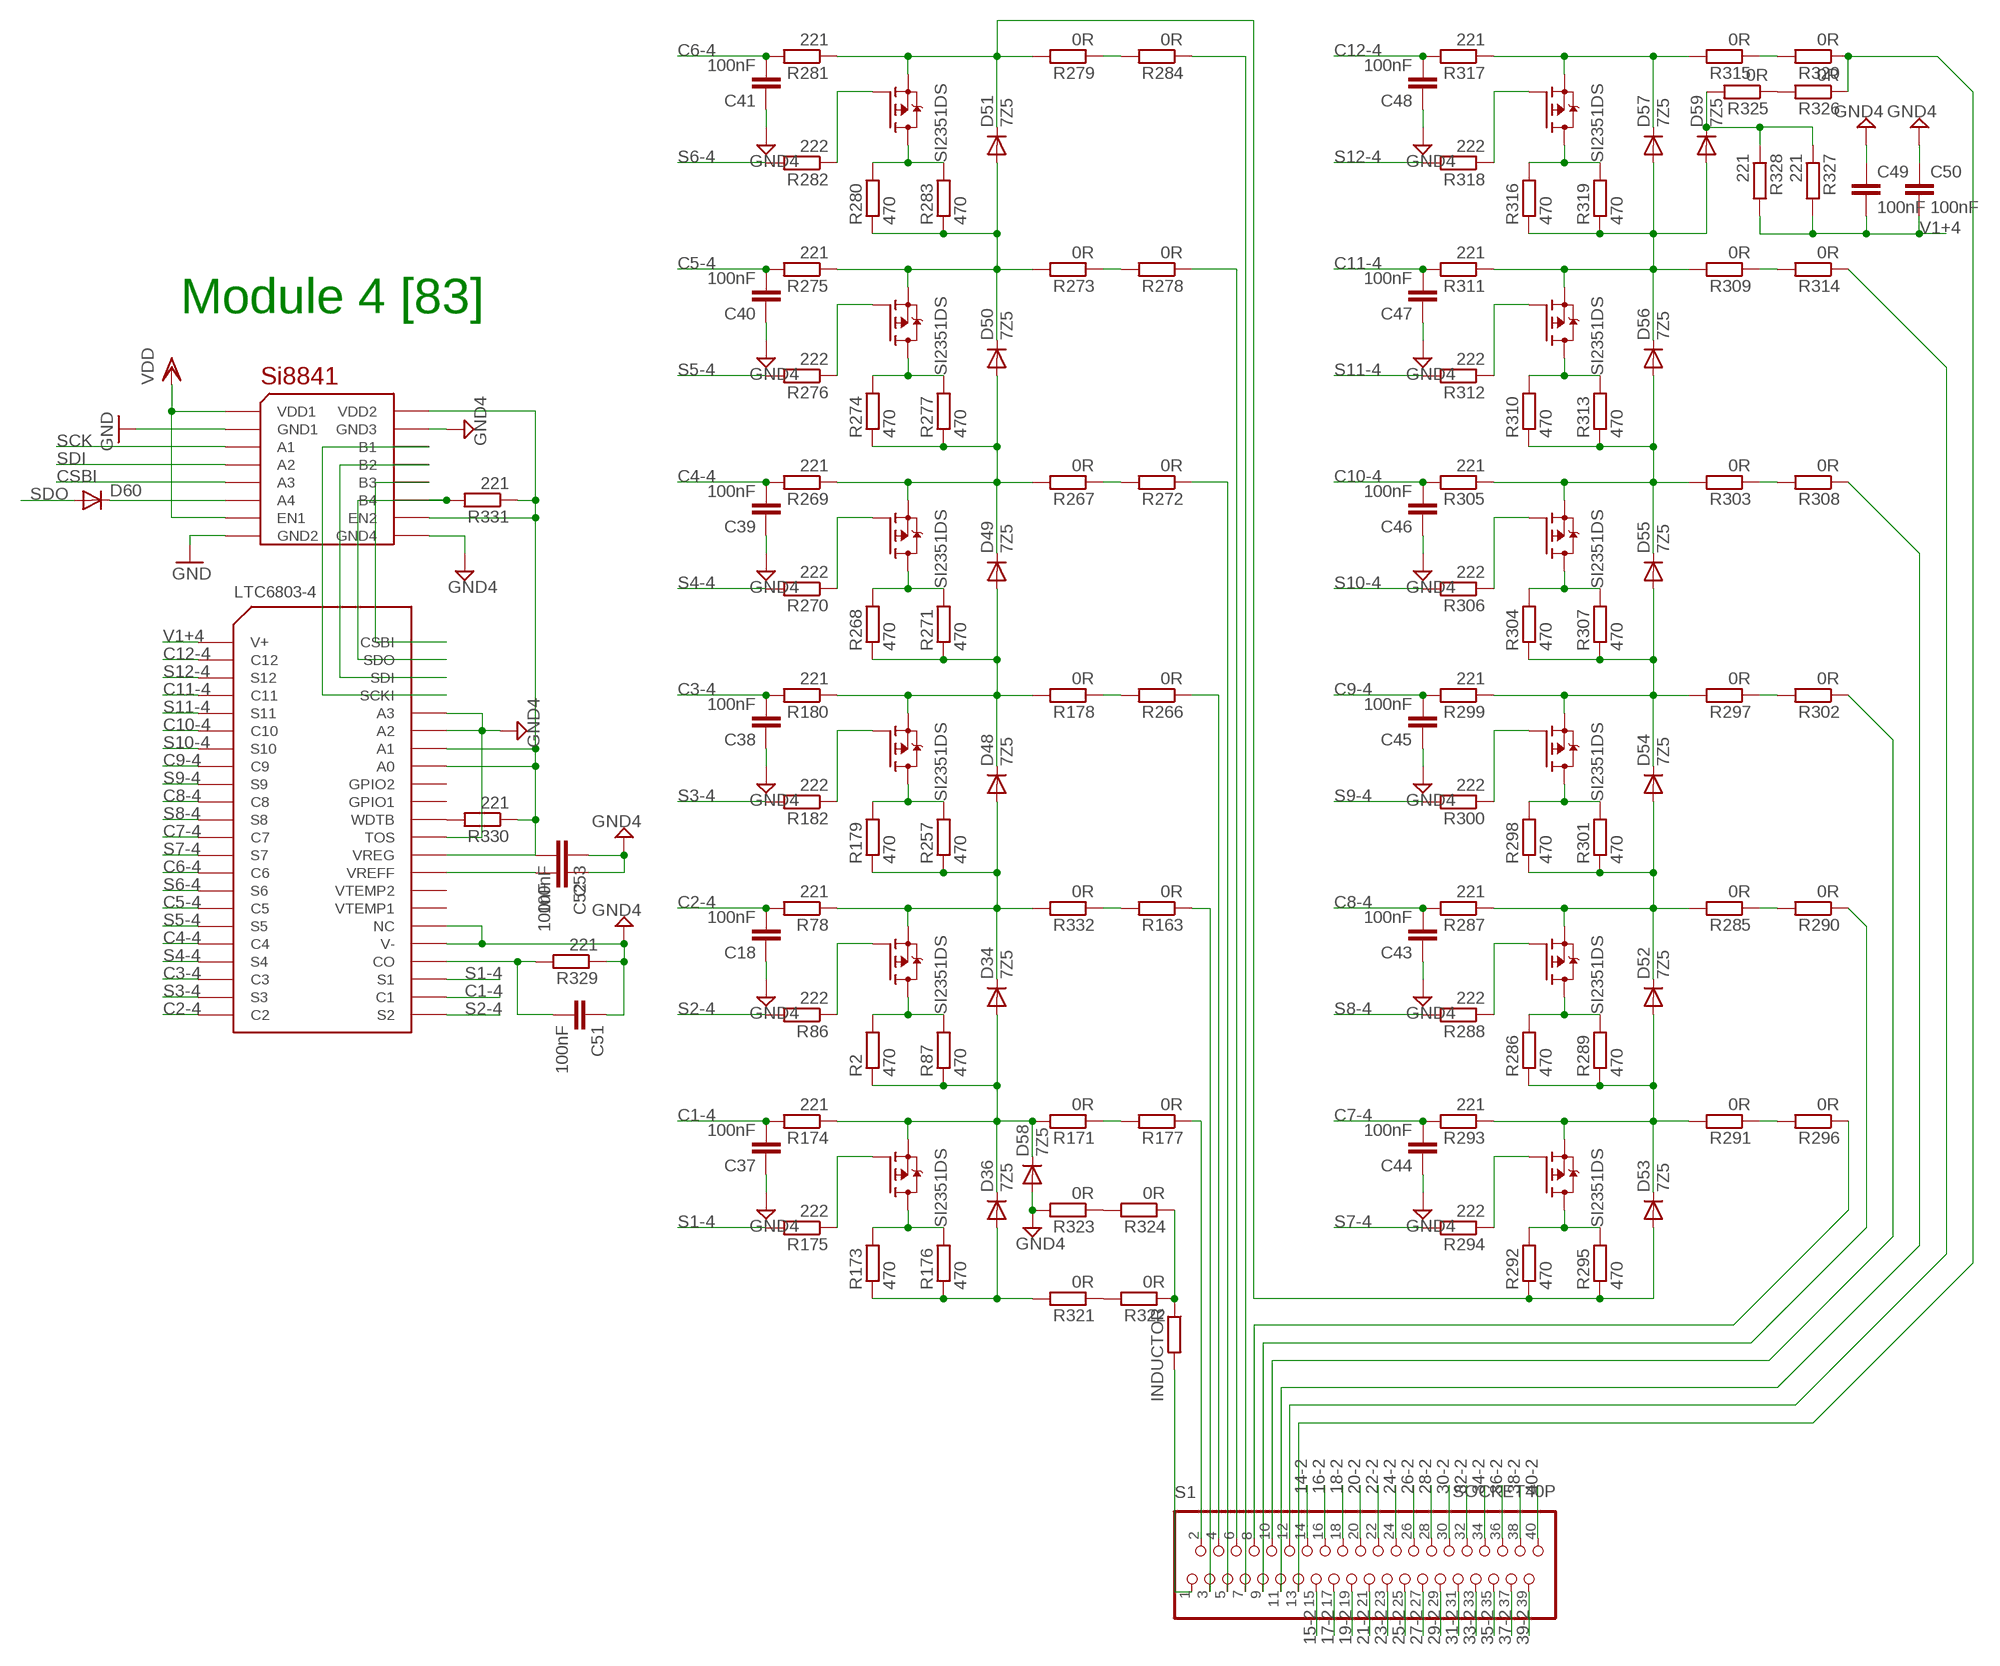
[diagram p3: schematic, sheet 4]

### Parts
C18  100nF  C-EUC0805K  [C0805K]
C37  100nF  C-EUC0805K  [C0805K]
C38  100nF  C-EUC0805K  [C0805K]
C39  100nF  C-EUC0805K  [C0805K]
C40  100nF  C-EUC0805K  [C0805K]
C41  100nF  C-EUC0805K  [C0805K]
C43  100nF  C-EUC0805K  [C0805K]
C44  100nF  C-EUC0805K  [C0805K]
C45  100nF  C-EUC0805K  [C0805K]
C46  100nF  C-EUC0805K  [C0805K]
C47  100nF  C-EUC0805K  [C0805K]
C48  100nF  C-EUC0805K  [C0805K]
C49  100nF  C-EUC0805K  [C0805K]
C50  100nF  C-EUC0805K  [C0805K]
C51  100nF  C-EUC0805K  [C0805K]
C52  100nF  C-EUC0805K  [C0805K]
C53  100nF  C-EUC0805K  [C0805K]
D34  7Z5  DIODE-SMB  [SMB]
D36  7Z5  DIODE-SMB  [SMB]
D48  7Z5  DIODE-SMB  [SMB]
D49  7Z5  DIODE-SMB  [SMB]
D50  7Z5  DIODE-SMB  [SMB]
D51  7Z5  DIODE-SMB  [SMB]
D52  7Z5  DIODE-SMB  [SMB]
D53  7Z5  DIODE-SMB  [SMB]
D54  7Z5  DIODE-SMB  [SMB]
D55  7Z5  DIODE-SMB  [SMB]
D56  7Z5  DIODE-SMB  [SMB]
D57  7Z5  DIODE-SMB  [SMB]
D58  7Z5  DIODE-SMB  [SMB]
D59  7Z5  DIODE-SMB  [SMB]
D60  DIODE-SOD123  [SOD123]
R2  470  R-EU_R6332  [R6332]
R78  221  R-EU_R0805  [R0805]
R86  222  R-EU_R0805  [R0805]
R87  470  R-EU_R6332  [R6332]
R163  0R  R-EU_M1206  [M1206]
R171  0R  R-EU_M1206  [M1206]
R173  470  R-EU_R6332  [R6332]
R174  221  R-EU_R0805  [R0805]
R175  222  R-EU_R0805  [R0805]
R176  470  R-EU_R6332  [R6332]
R177  0R  R-EU_M1206  [M1206]
R178  0R  R-EU_M1206  [M1206]
R179  470  R-EU_R6332  [R6332]
R180  221  R-EU_R0805  [R0805]
R182  222  R-EU_R0805  [R0805]
R257  470  R-EU_R6332  [R6332]
R266  0R  R-EU_M1206  [M1206]
R267  0R  R-EU_M1206  [M1206]
R268  470  R-EU_R6332  [R6332]
R269  221  R-EU_R0805  [R0805]
R270  222  R-EU_R0805  [R0805]
R271  470  R-EU_R6332  [R6332]
R272  0R  R-EU_M1206  [M1206]
R273  0R  R-EU_M1206  [M1206]
R274  470  R-EU_R6332  [R6332]
R275  221  R-EU_R0805  [R0805]
R276  222  R-EU_R0805  [R0805]
R277  470  R-EU_R6332  [R6332]
R278  0R  R-EU_M1206  [M1206]
R279  0R  R-EU_M1206  [M1206]
R280  470  R-EU_R6332  [R6332]
R281  221  R-EU_R0805  [R0805]
R282  222  R-EU_R0805  [R0805]
R283  470  R-EU_R6332  [R6332]
R284  0R  R-EU_M1206  [M1206]
R285  0R  R-EU_M1206  [M1206]
R286  470  R-EU_R6332  [R6332]
R287  221  R-EU_R0805  [R0805]
R288  222  R-EU_R0805  [R0805]
R289  470  R-EU_R6332  [R6332]
R290  0R  R-EU_M1206  [M1206]
R291  0R  R-EU_M1206  [M1206]
R292  470  R-EU_R6332  [R6332]
R293  221  R-EU_R0805  [R0805]
R294  222  R-EU_R0805  [R0805]
R295  470  R-EU_R6332  [R6332]
R296  0R  R-EU_M1206  [M1206]
R297  0R  R-EU_M1206  [M1206]
R298  470  R-EU_R6332  [R6332]
R299  221  R-EU_R0805  [R0805]
R300  222  R-EU_R0805  [R0805]
R301  470  R-EU_R6332  [R6332]
R302  0R  R-EU_M1206  [M1206]
R303  0R  R-EU_M1206  [M1206]
R304  470  R-EU_R6332  [R6332]
R305  221  R-EU_R0805  [R0805]
R306  222  R-EU_R0805  [R0805]
R307  470  R-EU_R6332  [R6332]
R308  0R  R-EU_M1206  [M1206]
R309  0R  R-EU_M1206  [M1206]
R310  470  R-EU_R6332  [R6332]
R311  221  R-EU_R0805  [R0805]
R312  222  R-EU_R0805  [R0805]
R313  470  R-EU_R6332  [R6332]
R314  0R  R-EU_M1206  [M1206]
R315  0R  R-EU_M1206  [M1206]
R316  470  R-EU_R6332  [R6332]
R317  221  R-EU_R0805  [R0805]
R318  222  R-EU_R0805  [R0805]
R319  470  R-EU_R6332  [R6332]
R320  0R  R-EU_M1206  [M1206]
R321  0R  R-EU_M1206  [M1206]
R322  0R  R-EU_M1206  [M1206]
R323  0R  R-EU_M1206  [M1206]
R324  0R  R-EU_M1206  [M1206]
R325  0R  R-EU_M1206  [M1206]
R326  0R  R-EU_M1206  [M1206]
R327  221  R-EU_R0805  [R0805]
R328  221  R-EU_R0805  [R0805]
R329  221  R-EU_R0805  [R0805]
R330  221  R-EU_R0805  [R0805]
R331  221  R-EU_R0805  [R0805]
R332  0R  R-EU_M1206  [M1206]
S1  SOCKET40P  [40PIN]
U$31  LTC6803-4  [SSOP44]
U$32  SI8841  [SO16]
U$33  SI2351DS  [SOT23]
U$43  SI2351DS  [SOT23]
U$44  SI2351DS  [SOT23]
U$51  SI2351DS  [SOT23]
U$52  SI2351DS  [SOT23]
U$53  SI2351DS  [SOT23]
U$54  SI2351DS  [SOT23]
U$55  SI2351DS  [SOT23]
U$56  SI2351DS  [SOT23]
U$57  SI2351DS  [SOT23]
U$58  SI2351DS  [SOT23]
U$59  SI2351DS  [SOT23]
U$60  INDUCTOR  [L2012C]

### Nets
14-2: S1.14 ; also sheet 5
15-2: S1.15 ; also sheet 5
16-2: S1.16 ; also sheet 5
17-2: S1.17 ; also sheet 5
18-2: S1.18 ; also sheet 5
19-2: S1.19 ; also sheet 5
20-2: S1.20 ; also sheet 5
21-2: S1.21 ; also sheet 5
22-2: S1.22 ; also sheet 5
23-2: S1.23 ; also sheet 5
24-2: S1.24 ; also sheet 5
25-2: S1.25 ; also sheet 5
26-2: S1.26 ; also sheet 5
27-2: S1.27
28-2: S1.28 ; also sheet 6
29-2: S1.29 ; also sheet 6
30-2: S1.30 ; also sheet 6
31-2: S1.31 ; also sheet 6
32-2: S1.32 ; also sheet 6
33-2: S1.33 ; also sheet 6
34-2: S1.34 ; also sheet 6
35-2: S1.35 ; also sheet 6
36-2: S1.36 ; also sheet 6
37-2: S1.37 ; also sheet 6
38-2: S1.38 ; also sheet 6
39-2: S1.39 ; also sheet 6
40-2: S1.40 ; also sheet 6
C1-4: C37.2 R174.2 U$31.24(C1)
C2-4: C18.2 R78.2 U$31.P$22(C2)
C3-4: C38.2 R180.2 U$31.P$20(C3)
C4-4: C39.2 R269.2 U$31.P$18(C4)
C5-4: C40.2 R275.2 U$31.P$16(C5)
C6-4: C41.2 R281.2 U$31.P$14(C6)
C7-4: C44.2 R293.2 U$31.P$12(C7)
C8-4: C43.2 R287.2 U$31.P$10(C8)
C9-4: C45.2 R299.2 U$31.P$8(C9)
C10-4: C46.2 R305.2 U$31.P$6(C10)
C11-4: C47.2 R311.2 U$31.P$4(C11)
C12-4: C48.2 R317.2 U$31.P$2(C12)
CSBI: U$32.5(A3) ; also sheet 1,2,3,5,6,7,8,9
GND: U$32.2(GND1) U$32.8(GND2) ; also sheet 1,2,3,5,6,7,8,9
GND4: C18.1 C37.1 C38.1 C39.1 C40.1 C41.1 C43.1 C44.1 C45.1 C46.1 C47.1 C48.1 C49.1 C50.1 C51.1 C52.1 C53.1 D58.A R323.2 R329.1 U$31.27(V-) U$31.28(NC) U$31.33(TOS) U$31.39(A2) U$31.40(A3) U$32.9(GND4) U$32.15(GND3)
N$54: R86.1 U$33.1(G)
N$129: R2.2 R87.2 U$33.3(D)
N$154: D34.A D36.C D58.C R2.1 R87.1 R171.2 R174.1 U$43.2(S)
N$155: R163.2 R332.1
N$156: R175.1 U$43.1(G)
N$157: R173.2 R176.2 U$43.3(D)
N$158: R171.1 R177.2
N$160: R182.1 U$44.1(G)
N$161: R179.2 R257.2 U$44.3(D)
N$162: D34.C D48.A R78.1 R179.1 R257.1 R332.2 U$33.2(S)
N$163: R178.1 R266.2
N$164: R270.1 U$51.1(G)
N$165: R268.2 R271.2 U$51.3(D)
N$167: D48.C D49.A R178.2 R180.1 R268.1 R271.1 U$44.2(S)
N$169: R267.1 R272.2
N$170: R276.1 U$52.1(G)
N$173: R274.2 R277.2 U$52.3(D)
N$175: D49.C D50.A R267.2 R269.1 R274.1 R277.1 U$51.2(S)
N$177: R273.1 R278.2
N$207: R282.1 U$53.1(G)
N$208: R280.2 R283.2 U$53.3(D)
N$209: D50.C D51.A R273.2 R275.1 R280.1 R283.1 U$52.2(S)
N$214: R279.1 R284.2
N$226: R288.1 U$54.1(G)
N$227: R286.2 R289.2 U$54.3(D)
N$228: D52.A D53.C R286.1 R289.1 R291.2 R293.1 U$55.2(S)
N$229: R285.1 R290.2
N$230: R294.1 U$55.1(G)
N$231: R292.2 R295.2 U$55.3(D)
N$232: D51.C D53.A R279.2 R281.1 R292.1 R295.1 U$53.2(S)
N$233: R291.1 R296.2
N$234: R300.1 U$56.1(G)
N$235: R298.2 R301.2 U$56.3(D)
N$236: D52.C D54.A R285.2 R287.1 R298.1 R301.1 U$54.2(S)
N$237: R297.1 R302.2
N$238: R306.1 U$57.1(G)
N$239: R304.2 R307.2 U$57.3(D)
N$240: D54.C D55.A R297.2 R299.1 R304.1 R307.1 U$56.2(S)
N$241: R303.1 R308.2
N$242: R312.1 U$58.1(G)
N$243: R310.2 R313.2 U$58.3(D)
N$244: D55.C D56.A R303.2 R305.1 R310.1 R313.1 U$57.2(S)
N$245: R309.1 R314.2
N$246: D57.C R315.2 R317.1 U$59.2(S)
N$247: R318.1 U$59.1(G)
N$248: R316.2 R319.2 U$59.3(D)
N$249: D56.C D57.A D59.A R309.2 R311.1 R316.1 R319.1 U$58.2(S)
N$250: R315.1 R320.2
N$251: R321.1 R322.2
N$252: R322.1 R324.1 U$60.1
N$253: D36.A R173.1 R176.1 R321.2
N$254: R323.1 R324.2
N$255: R325.1 R326.2
N$256: D59.C R325.2 R327.1 R328.1
N$257: R320.1 R326.1 S1.13
N$258: C51.2 R329.2 U$31.26(CO)
N$259: C52.2 U$31.31(VREFF)
N$260: C53.2 R330.1 R331.1 U$31.32(VREG) U$31.37(A0) U$31.38(A1) U$32.10(EN2) U$32.16(VDD2)
N$261: R330.2 U$31.34(WDTB)
N$262: R331.2 U$31.43(SDO) U$32.11(B4)
N$263: U$31.44(CSBI) U$32.12(B3)
N$264: U$31.42(SDI) U$32.13(B2)
N$265: U$31.41(SCKI) U$32.14(B1)
N$266: S1.1 U$60.2
N$267: R177.1 S1.2
N$268: R163.1 S1.3
N$269: R266.1 S1.4
N$270: R272.1 S1.5
N$271: R278.1 S1.6
N$272: R284.1 S1.7
N$273: R296.1 S1.8
N$274: R290.1 S1.9
N$275: R302.1 S1.10
N$276: R308.1 S1.11
N$277: R314.1 S1.12
N$278: D60.C U$32.6(A4)
S1-4: R175.2 U$31.25(S1)
S2-4: R86.2 U$31.23(S2)
S3-4: R182.2 U$31.P$21(S3)
S4-4: R270.2 U$31.P$19(S4)
S5-4: R276.2 U$31.P$17(S5)
S6-4: R282.2 U$31.P$15(S6)
S7-4: R294.2 U$31.P$13(S7)
S8-4: R288.2 U$31.P$11(S8)
S9-4: R300.2 U$31.P$9(S9)
S10-4: R306.2 U$31.P$7(S10)
S11-4: R312.2 U$31.P$5(S11)
S12-4: R318.2 U$31.P$3(S12)
SCK: U$32.3(A1) ; also sheet 1,2,3,5,6,7,8,9
SDI: U$32.4(A2) ; also sheet 1,2,3,5,6,7,8,9
SDO: D60.A ; also sheet 1,2,3,5,6,7,8,9
V1+4: C49.2 C50.2 R327.2 R328.2 U$31.P$1(V+)
VDD: U$32.1(VDD1) U$32.7(EN1) ; also sheet 1,2,3,5,6,7,8,9
Unconnected: U$31.29(VTEMP1) U$31.30(VTEMP2) U$31.35(GPIO1) U$31.36(GPIO2)

### Notes on the sheet
- Module 4 [83]

## Sheet 5 of 9
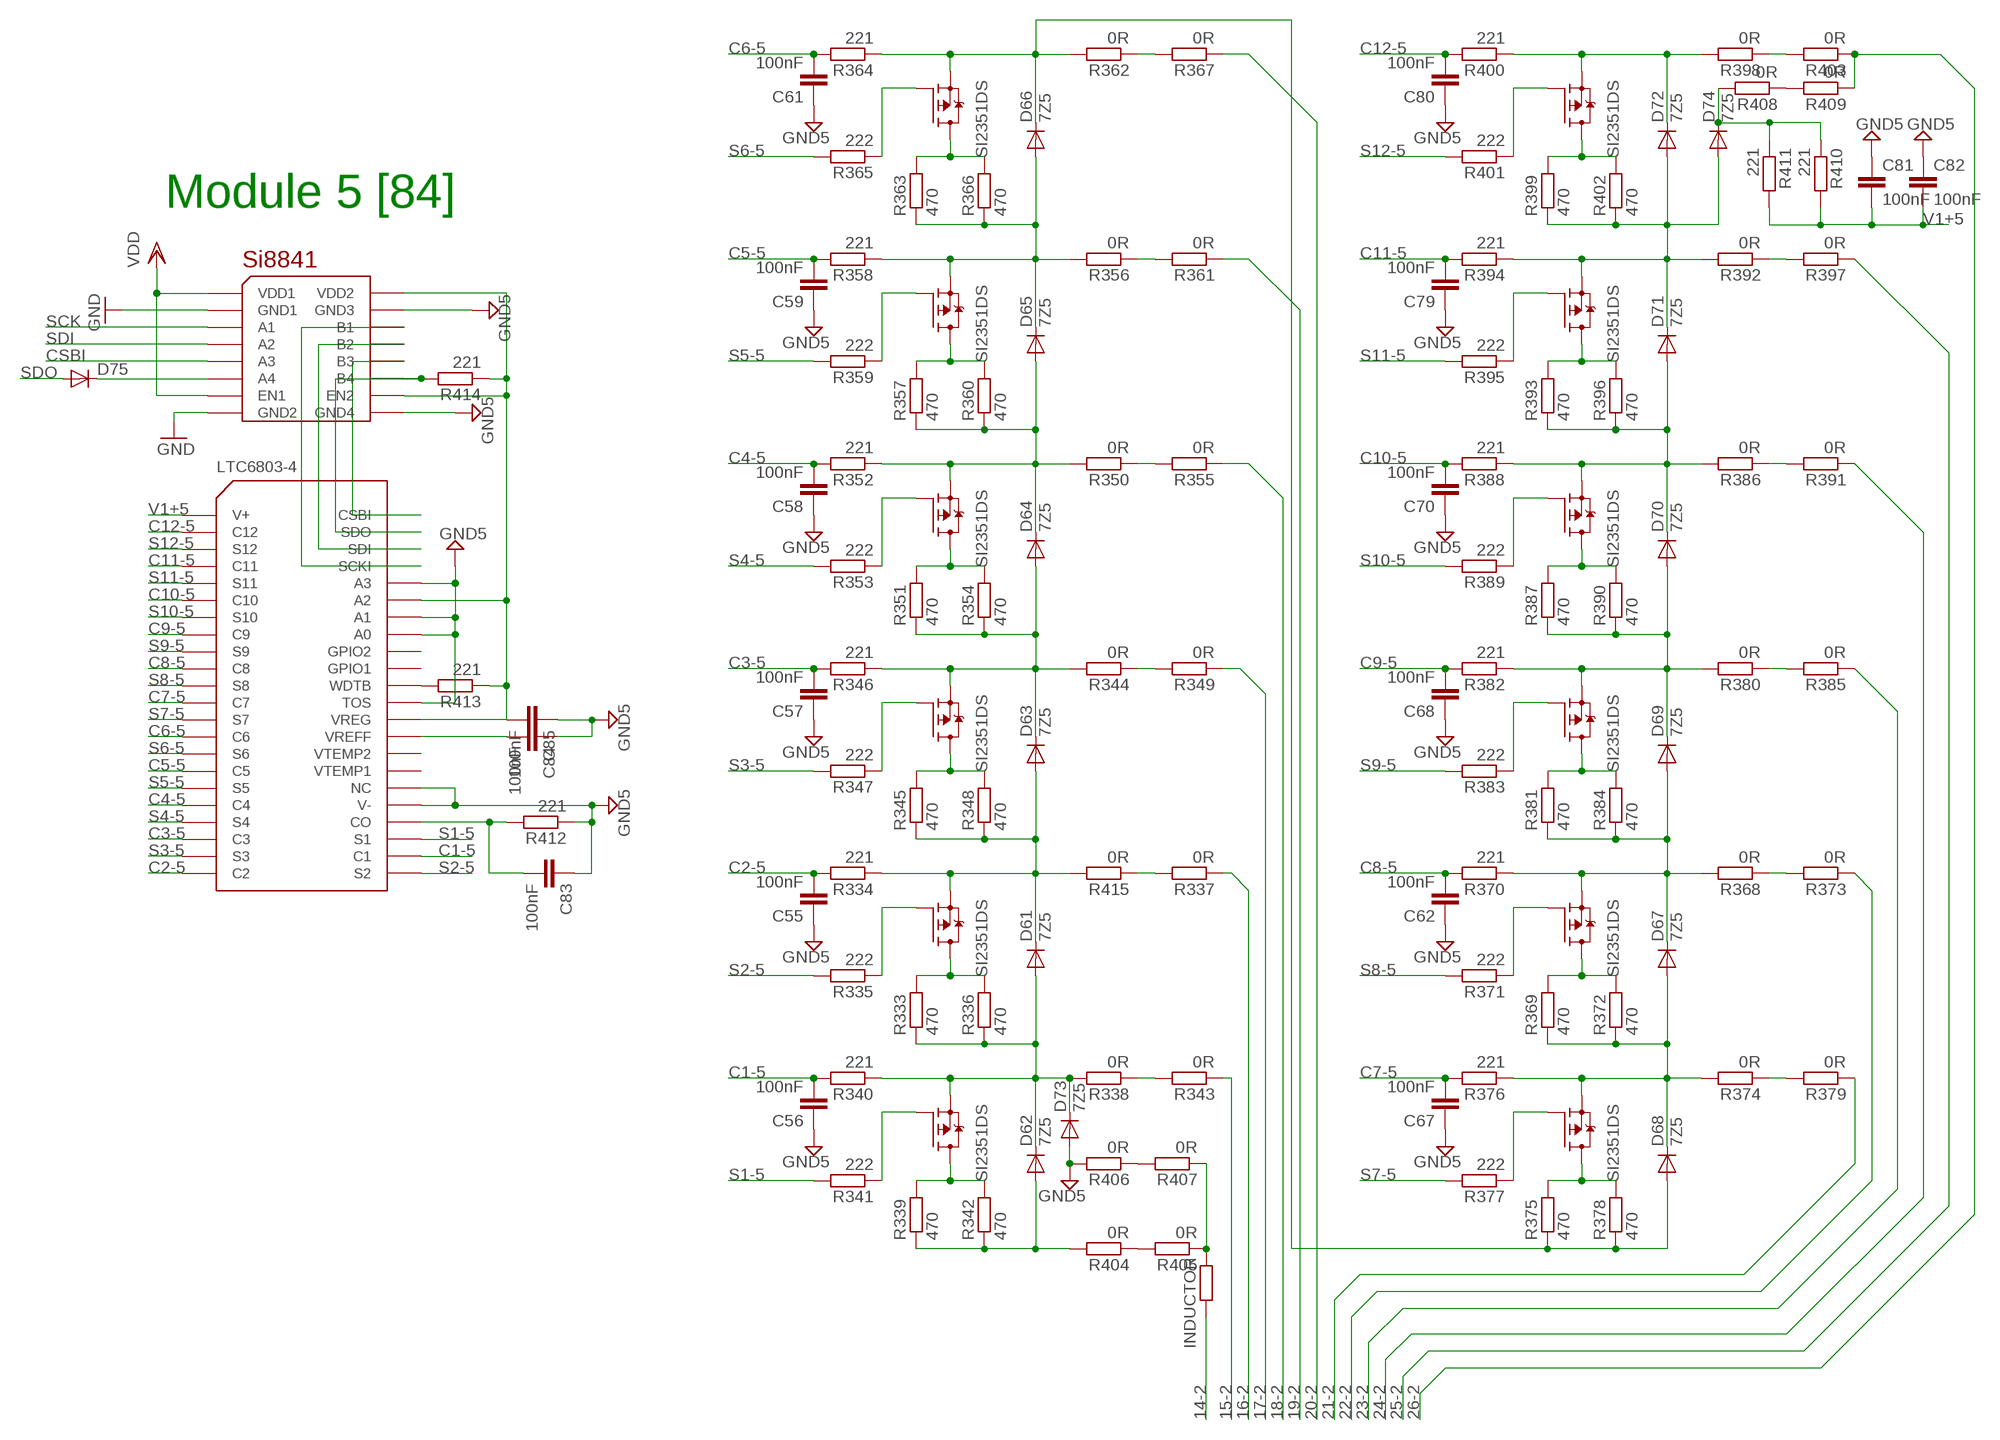
[diagram p4: schematic, sheet 5]

### Parts
C55  100nF  C-EUC0805K  [C0805K]
C56  100nF  C-EUC0805K  [C0805K]
C57  100nF  C-EUC0805K  [C0805K]
C58  100nF  C-EUC0805K  [C0805K]
C59  100nF  C-EUC0805K  [C0805K]
C61  100nF  C-EUC0805K  [C0805K]
C62  100nF  C-EUC0805K  [C0805K]
C67  100nF  C-EUC0805K  [C0805K]
C68  100nF  C-EUC0805K  [C0805K]
C70  100nF  C-EUC0805K  [C0805K]
C79  100nF  C-EUC0805K  [C0805K]
C80  100nF  C-EUC0805K  [C0805K]
C81  100nF  C-EUC0805K  [C0805K]
C82  100nF  C-EUC0805K  [C0805K]
C83  100nF  C-EUC0805K  [C0805K]
C84  100nF  C-EUC0805K  [C0805K]
C85  100nF  C-EUC0805K  [C0805K]
D61  7Z5  DIODE-SMB  [SMB]
D62  7Z5  DIODE-SMB  [SMB]
D63  7Z5  DIODE-SMB  [SMB]
D64  7Z5  DIODE-SMB  [SMB]
D65  7Z5  DIODE-SMB  [SMB]
D66  7Z5  DIODE-SMB  [SMB]
D67  7Z5  DIODE-SMB  [SMB]
D68  7Z5  DIODE-SMB  [SMB]
D69  7Z5  DIODE-SMB  [SMB]
D70  7Z5  DIODE-SMB  [SMB]
D71  7Z5  DIODE-SMB  [SMB]
D72  7Z5  DIODE-SMB  [SMB]
D73  7Z5  DIODE-SMB  [SMB]
D74  7Z5  DIODE-SMB  [SMB]
D75  DIODE-SOD123  [SOD123]
R333  470  R-EU_R6332  [R6332]
R334  221  R-EU_R0805  [R0805]
R335  222  R-EU_R0805  [R0805]
R336  470  R-EU_R6332  [R6332]
R337  0R  R-EU_M1206  [M1206]
R338  0R  R-EU_M1206  [M1206]
R339  470  R-EU_R6332  [R6332]
R340  221  R-EU_R0805  [R0805]
R341  222  R-EU_R0805  [R0805]
R342  470  R-EU_R6332  [R6332]
R343  0R  R-EU_M1206  [M1206]
R344  0R  R-EU_M1206  [M1206]
R345  470  R-EU_R6332  [R6332]
R346  221  R-EU_R0805  [R0805]
R347  222  R-EU_R0805  [R0805]
R348  470  R-EU_R6332  [R6332]
R349  0R  R-EU_M1206  [M1206]
R350  0R  R-EU_M1206  [M1206]
R351  470  R-EU_R6332  [R6332]
R352  221  R-EU_R0805  [R0805]
R353  222  R-EU_R0805  [R0805]
R354  470  R-EU_R6332  [R6332]
R355  0R  R-EU_M1206  [M1206]
R356  0R  R-EU_M1206  [M1206]
R357  470  R-EU_R6332  [R6332]
R358  221  R-EU_R0805  [R0805]
R359  222  R-EU_R0805  [R0805]
R360  470  R-EU_R6332  [R6332]
R361  0R  R-EU_M1206  [M1206]
R362  0R  R-EU_M1206  [M1206]
R363  470  R-EU_R6332  [R6332]
R364  221  R-EU_R0805  [R0805]
R365  222  R-EU_R0805  [R0805]
R366  470  R-EU_R6332  [R6332]
R367  0R  R-EU_M1206  [M1206]
R368  0R  R-EU_M1206  [M1206]
R369  470  R-EU_R6332  [R6332]
R370  221  R-EU_R0805  [R0805]
R371  222  R-EU_R0805  [R0805]
R372  470  R-EU_R6332  [R6332]
R373  0R  R-EU_M1206  [M1206]
R374  0R  R-EU_M1206  [M1206]
R375  470  R-EU_R6332  [R6332]
R376  221  R-EU_R0805  [R0805]
R377  222  R-EU_R0805  [R0805]
R378  470  R-EU_R6332  [R6332]
R379  0R  R-EU_M1206  [M1206]
R380  0R  R-EU_M1206  [M1206]
R381  470  R-EU_R6332  [R6332]
R382  221  R-EU_R0805  [R0805]
R383  222  R-EU_R0805  [R0805]
R384  470  R-EU_R6332  [R6332]
R385  0R  R-EU_M1206  [M1206]
R386  0R  R-EU_M1206  [M1206]
R387  470  R-EU_R6332  [R6332]
R388  221  R-EU_R0805  [R0805]
R389  222  R-EU_R0805  [R0805]
R390  470  R-EU_R6332  [R6332]
R391  0R  R-EU_M1206  [M1206]
R392  0R  R-EU_M1206  [M1206]
R393  470  R-EU_R6332  [R6332]
R394  221  R-EU_R0805  [R0805]
R395  222  R-EU_R0805  [R0805]
R396  470  R-EU_R6332  [R6332]
R397  0R  R-EU_M1206  [M1206]
R398  0R  R-EU_M1206  [M1206]
R399  470  R-EU_R6332  [R6332]
R400  221  R-EU_R0805  [R0805]
R401  222  R-EU_R0805  [R0805]
R402  470  R-EU_R6332  [R6332]
R403  0R  R-EU_M1206  [M1206]
R404  0R  R-EU_M1206  [M1206]
R405  0R  R-EU_M1206  [M1206]
R406  0R  R-EU_M1206  [M1206]
R407  0R  R-EU_M1206  [M1206]
R408  0R  R-EU_M1206  [M1206]
R409  0R  R-EU_M1206  [M1206]
R410  221  R-EU_R0805  [R0805]
R411  221  R-EU_R0805  [R0805]
R412  221  R-EU_R0805  [R0805]
R413  221  R-EU_R0805  [R0805]
R414  221  R-EU_R0805  [R0805]
R415  0R  R-EU_M1206  [M1206]
U$61  LTC6803-4  [SSOP44]
U$62  SI8841  [SO16]
U$63  SI2351DS  [SOT23]
U$64  SI2351DS  [SOT23]
U$65  SI2351DS  [SOT23]
U$66  SI2351DS  [SOT23]
U$67  SI2351DS  [SOT23]
U$68  SI2351DS  [SOT23]
U$69  SI2351DS  [SOT23]
U$70  SI2351DS  [SOT23]
U$71  SI2351DS  [SOT23]
U$72  SI2351DS  [SOT23]
U$73  SI2351DS  [SOT23]
U$74  SI2351DS  [SOT23]
U$75  INDUCTOR  [L2012C]

### Nets
14-2: U$75.2 ; also sheet 4
15-2: R343.1 ; also sheet 4
16-2: R337.1 ; also sheet 4
17-2: R349.1 ; also sheet 4
18-2: R355.1 ; also sheet 4
19-2: R361.1 ; also sheet 4
20-2: R367.1 ; also sheet 4
21-2: R379.1 ; also sheet 4
22-2: R373.1 ; also sheet 4
23-2: R385.1 ; also sheet 4
24-2: R391.1 ; also sheet 4
25-2: R397.1 ; also sheet 4
26-2: R403.1 R409.1 ; also sheet 4
C1-5: C56.2 R340.2 U$61.24(C1)
C2-5: C55.2 R334.2 U$61.P$22(C2)
C3-5: C57.2 R346.2 U$61.P$20(C3)
C4-5: C58.2 R352.2 U$61.P$18(C4)
C5-5: C59.2 R358.2 U$61.P$16(C5)
C6-5: C61.2 R364.2 U$61.P$14(C6)
C7-5: C67.2 R376.2 U$61.P$12(C7)
C8-5: C62.2 R370.2 U$61.P$10(C8)
C9-5: C68.2 R382.2 U$61.P$8(C9)
C10-5: C70.2 R388.2 U$61.P$6(C10)
C11-5: C79.2 R394.2 U$61.P$4(C11)
C12-5: C80.2 R400.2 U$61.P$2(C12)
CSBI: U$62.5(A3) ; also sheet 1,2,3,4,6,7,8,9
GND: U$62.2(GND1) U$62.8(GND2) ; also sheet 1,2,3,4,6,7,8,9
GND5: C55.1 C56.1 C57.1 C58.1 C59.1 C61.1 C62.1 C67.1 C68.1 C70.1 C79.1 C80.1 C81.1 C82.1 C83.1 C84.1 C85.1 D73.A R406.2 R412.1 U$61.27(V-) U$61.28(NC) U$61.33(TOS) U$61.37(A0) U$61.38(A1) U$61.40(A3) U$62.9(GND4) U$62.15(GND3)
N$279: R335.1 U$63.1(G)
N$280: R333.2 R336.2 U$63.3(D)
N$281: D61.A D62.C D73.C R333.1 R336.1 R338.2 R340.1 U$64.2(S)
N$282: R337.2 R415.1
N$283: R341.1 U$64.1(G)
N$284: R339.2 R342.2 U$64.3(D)
N$285: R338.1 R343.2
N$286: R347.1 U$65.1(G)
N$287: R345.2 R348.2 U$65.3(D)
N$288: D61.C D63.A R334.1 R345.1 R348.1 R415.2 U$63.2(S)
N$289: R344.1 R349.2
N$290: R353.1 U$66.1(G)
N$291: R351.2 R354.2 U$66.3(D)
N$292: D63.C D64.A R344.2 R346.1 R351.1 R354.1 U$65.2(S)
N$293: R350.1 R355.2
N$294: R359.1 U$67.1(G)
N$295: R357.2 R360.2 U$67.3(D)
N$296: D64.C D65.A R350.2 R352.1 R357.1 R360.1 U$66.2(S)
N$297: R356.1 R361.2
N$298: R365.1 U$68.1(G)
N$299: R363.2 R366.2 U$68.3(D)
N$300: D65.C D66.A R356.2 R358.1 R363.1 R366.1 U$67.2(S)
N$301: R362.1 R367.2
N$302: R371.1 U$69.1(G)
N$303: R369.2 R372.2 U$69.3(D)
N$304: D67.A D68.C R369.1 R372.1 R374.2 R376.1 U$70.2(S)
N$305: R368.1 R373.2
N$306: R377.1 U$70.1(G)
N$307: R375.2 R378.2 U$70.3(D)
N$308: D66.C D68.A R362.2 R364.1 R375.1 R378.1 U$68.2(S)
N$309: R374.1 R379.2
N$310: R383.1 U$71.1(G)
N$311: R381.2 R384.2 U$71.3(D)
N$312: D67.C D69.A R368.2 R370.1 R381.1 R384.1 U$69.2(S)
N$313: R380.1 R385.2
N$314: R389.1 U$72.1(G)
N$315: R387.2 R390.2 U$72.3(D)
N$316: D69.C D70.A R380.2 R382.1 R387.1 R390.1 U$71.2(S)
N$317: R386.1 R391.2
N$318: R395.1 U$73.1(G)
N$319: R393.2 R396.2 U$73.3(D)
N$320: D70.C D71.A R386.2 R388.1 R393.1 R396.1 U$72.2(S)
N$321: R392.1 R397.2
N$322: D72.C R398.2 R400.1 U$74.2(S)
N$323: R401.1 U$74.1(G)
N$324: R399.2 R402.2 U$74.3(D)
N$325: D71.C D72.A D74.A R392.2 R394.1 R399.1 R402.1 U$73.2(S)
N$326: R398.1 R403.2
N$327: R404.1 R405.2
N$328: R405.1 R407.1 U$75.1
N$329: D62.A R339.1 R342.1 R404.2
N$330: R406.1 R407.2
N$331: R408.1 R409.2
N$332: D74.C R408.2 R410.1 R411.1
N$333: C83.2 R412.2 U$61.26(CO)
N$334: C84.2 U$61.31(VREFF)
N$335: C85.2 R413.1 R414.1 U$61.32(VREG) U$61.39(A2) U$62.10(EN2) U$62.16(VDD2)
N$336: R413.2 U$61.34(WDTB)
N$337: R414.2 U$61.43(SDO) U$62.11(B4)
N$338: U$61.44(CSBI) U$62.12(B3)
N$339: U$61.42(SDI) U$62.13(B2)
N$340: U$61.41(SCKI) U$62.14(B1)
N$341: D75.C U$62.6(A4)
S1-5: R341.2 U$61.25(S1)
S2-5: R335.2 U$61.23(S2)
S3-5: R347.2 U$61.P$21(S3)
S4-5: R353.2 U$61.P$19(S4)
S5-5: R359.2 U$61.P$17(S5)
S6-5: R365.2 U$61.P$15(S6)
S7-5: R377.2 U$61.P$13(S7)
S8-5: R371.2 U$61.P$11(S8)
S9-5: R383.2 U$61.P$9(S9)
S10-5: R389.2 U$61.P$7(S10)
S11-5: R395.2 U$61.P$5(S11)
S12-5: R401.2 U$61.P$3(S12)
SCK: U$62.3(A1) ; also sheet 1,2,3,4,6,7,8,9
SDI: U$62.4(A2) ; also sheet 1,2,3,4,6,7,8,9
SDO: D75.A ; also sheet 1,2,3,4,6,7,8,9
V1+5: C81.2 C82.2 R410.2 R411.2 U$61.P$1(V+)
VDD: U$62.1(VDD1) U$62.7(EN1) ; also sheet 1,2,3,4,6,7,8,9
Unconnected: U$61.29(VTEMP1) U$61.30(VTEMP2) U$61.35(GPIO1) U$61.36(GPIO2)

### Notes on the sheet
- Module 5 [84]

## Sheet 6 of 9
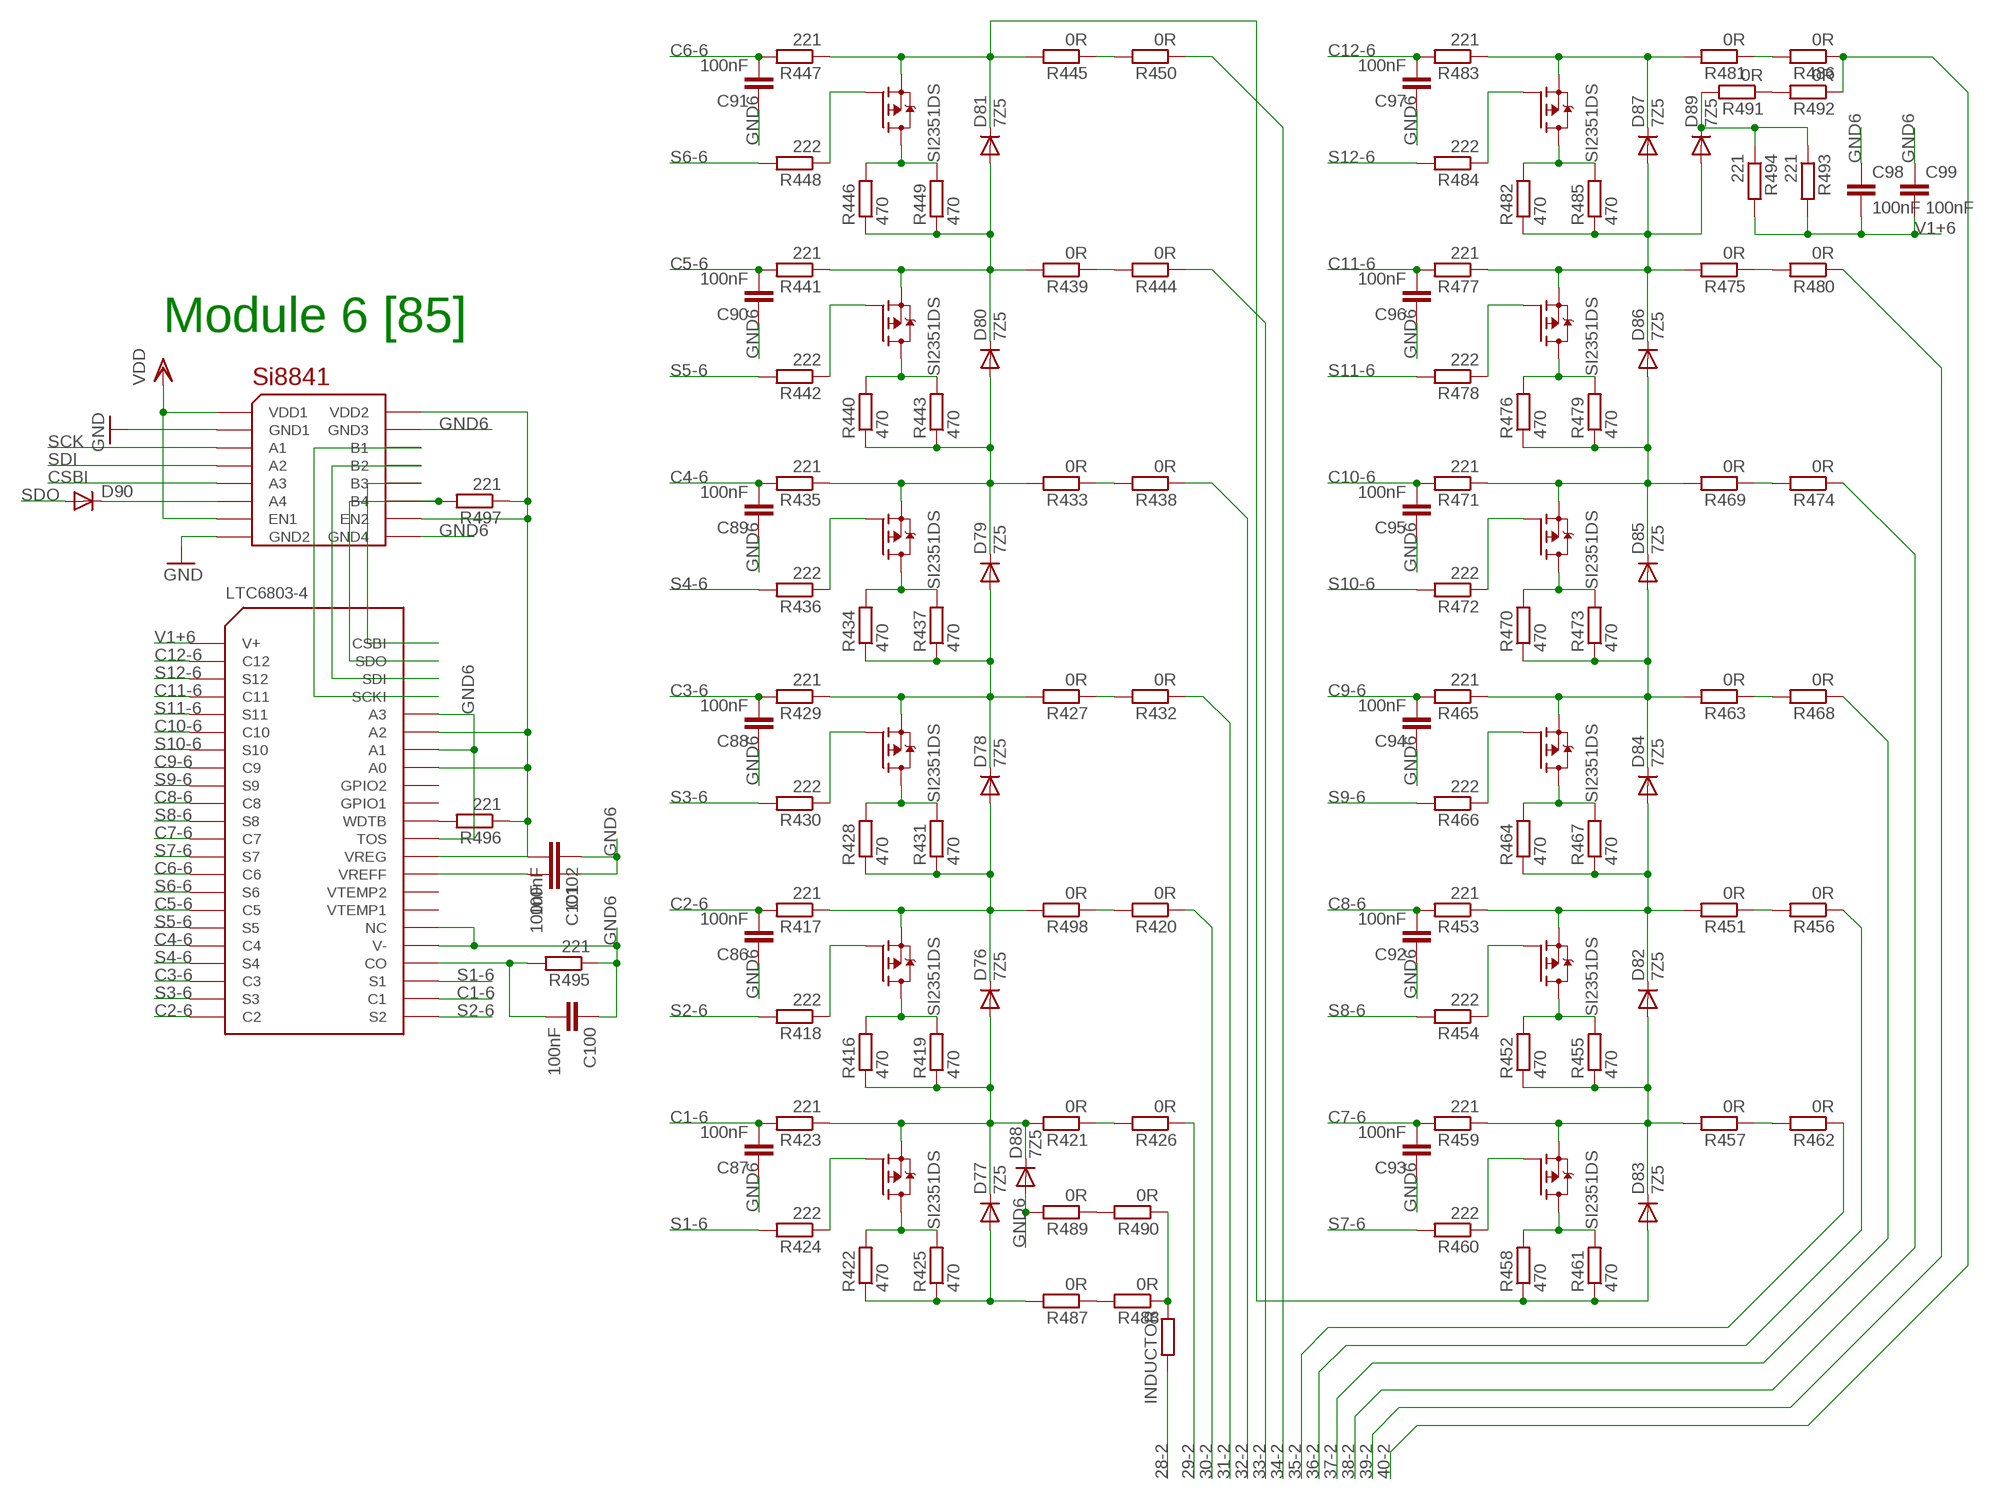
[diagram p5: schematic, sheet 6]

### Parts
C86  100nF  C-EUC0805K  [C0805K]
C87  100nF  C-EUC0805K  [C0805K]
C88  100nF  C-EUC0805K  [C0805K]
C89  100nF  C-EUC0805K  [C0805K]
C90  100nF  C-EUC0805K  [C0805K]
C91  100nF  C-EUC0805K  [C0805K]
C92  100nF  C-EUC0805K  [C0805K]
C93  100nF  C-EUC0805K  [C0805K]
C94  100nF  C-EUC0805K  [C0805K]
C95  100nF  C-EUC0805K  [C0805K]
C96  100nF  C-EUC0805K  [C0805K]
C97  100nF  C-EUC0805K  [C0805K]
C98  100nF  C-EUC0805K  [C0805K]
C99  100nF  C-EUC0805K  [C0805K]
C100  100nF  C-EUC0805K  [C0805K]
C101  100nF  C-EUC0805K  [C0805K]
C102  100nF  C-EUC0805K  [C0805K]
D76  7Z5  DIODE-SMB  [SMB]
D77  7Z5  DIODE-SMB  [SMB]
D78  7Z5  DIODE-SMB  [SMB]
D79  7Z5  DIODE-SMB  [SMB]
D80  7Z5  DIODE-SMB  [SMB]
D81  7Z5  DIODE-SMB  [SMB]
D82  7Z5  DIODE-SMB  [SMB]
D83  7Z5  DIODE-SMB  [SMB]
D84  7Z5  DIODE-SMB  [SMB]
D85  7Z5  DIODE-SMB  [SMB]
D86  7Z5  DIODE-SMB  [SMB]
D87  7Z5  DIODE-SMB  [SMB]
D88  7Z5  DIODE-SMB  [SMB]
D89  7Z5  DIODE-SMB  [SMB]
D90  DIODE-SOD123  [SOD123]
R416  470  R-EU_R6332  [R6332]
R417  221  R-EU_R0805  [R0805]
R418  222  R-EU_R0805  [R0805]
R419  470  R-EU_R6332  [R6332]
R420  0R  R-EU_M1206  [M1206]
R421  0R  R-EU_M1206  [M1206]
R422  470  R-EU_R6332  [R6332]
R423  221  R-EU_R0805  [R0805]
R424  222  R-EU_R0805  [R0805]
R425  470  R-EU_R6332  [R6332]
R426  0R  R-EU_M1206  [M1206]
R427  0R  R-EU_M1206  [M1206]
R428  470  R-EU_R6332  [R6332]
R429  221  R-EU_R0805  [R0805]
R430  222  R-EU_R0805  [R0805]
R431  470  R-EU_R6332  [R6332]
R432  0R  R-EU_M1206  [M1206]
R433  0R  R-EU_M1206  [M1206]
R434  470  R-EU_R6332  [R6332]
R435  221  R-EU_R0805  [R0805]
R436  222  R-EU_R0805  [R0805]
R437  470  R-EU_R6332  [R6332]
R438  0R  R-EU_M1206  [M1206]
R439  0R  R-EU_M1206  [M1206]
R440  470  R-EU_R6332  [R6332]
R441  221  R-EU_R0805  [R0805]
R442  222  R-EU_R0805  [R0805]
R443  470  R-EU_R6332  [R6332]
R444  0R  R-EU_M1206  [M1206]
R445  0R  R-EU_M1206  [M1206]
R446  470  R-EU_R6332  [R6332]
R447  221  R-EU_R0805  [R0805]
R448  222  R-EU_R0805  [R0805]
R449  470  R-EU_R6332  [R6332]
R450  0R  R-EU_M1206  [M1206]
R451  0R  R-EU_M1206  [M1206]
R452  470  R-EU_R6332  [R6332]
R453  221  R-EU_R0805  [R0805]
R454  222  R-EU_R0805  [R0805]
R455  470  R-EU_R6332  [R6332]
R456  0R  R-EU_M1206  [M1206]
R457  0R  R-EU_M1206  [M1206]
R458  470  R-EU_R6332  [R6332]
R459  221  R-EU_R0805  [R0805]
R460  222  R-EU_R0805  [R0805]
R461  470  R-EU_R6332  [R6332]
R462  0R  R-EU_M1206  [M1206]
R463  0R  R-EU_M1206  [M1206]
R464  470  R-EU_R6332  [R6332]
R465  221  R-EU_R0805  [R0805]
R466  222  R-EU_R0805  [R0805]
R467  470  R-EU_R6332  [R6332]
R468  0R  R-EU_M1206  [M1206]
R469  0R  R-EU_M1206  [M1206]
R470  470  R-EU_R6332  [R6332]
R471  221  R-EU_R0805  [R0805]
R472  222  R-EU_R0805  [R0805]
R473  470  R-EU_R6332  [R6332]
R474  0R  R-EU_M1206  [M1206]
R475  0R  R-EU_M1206  [M1206]
R476  470  R-EU_R6332  [R6332]
R477  221  R-EU_R0805  [R0805]
R478  222  R-EU_R0805  [R0805]
R479  470  R-EU_R6332  [R6332]
R480  0R  R-EU_M1206  [M1206]
R481  0R  R-EU_M1206  [M1206]
R482  470  R-EU_R6332  [R6332]
R483  221  R-EU_R0805  [R0805]
R484  222  R-EU_R0805  [R0805]
R485  470  R-EU_R6332  [R6332]
R486  0R  R-EU_M1206  [M1206]
R487  0R  R-EU_M1206  [M1206]
R488  0R  R-EU_M1206  [M1206]
R489  0R  R-EU_M1206  [M1206]
R490  0R  R-EU_M1206  [M1206]
R491  0R  R-EU_M1206  [M1206]
R492  0R  R-EU_M1206  [M1206]
R493  221  R-EU_R0805  [R0805]
R494  221  R-EU_R0805  [R0805]
R495  221  R-EU_R0805  [R0805]
R496  221  R-EU_R0805  [R0805]
R497  221  R-EU_R0805  [R0805]
R498  0R  R-EU_M1206  [M1206]
U$76  LTC6803-4  [SSOP44]
U$77  SI8841  [SO16]
U$78  SI2351DS  [SOT23]
U$79  SI2351DS  [SOT23]
U$80  SI2351DS  [SOT23]
U$81  SI2351DS  [SOT23]
U$82  SI2351DS  [SOT23]
U$83  SI2351DS  [SOT23]
U$84  SI2351DS  [SOT23]
U$85  SI2351DS  [SOT23]
U$86  SI2351DS  [SOT23]
U$87  SI2351DS  [SOT23]
U$88  SI2351DS  [SOT23]
U$89  SI2351DS  [SOT23]
U$90  INDUCTOR  [L2012C]

### Nets
28-2: U$90.2 ; also sheet 4
29-2: R426.1 ; also sheet 4
30-2: R420.1 ; also sheet 4
31-2: R432.1 ; also sheet 4
32-2: R438.1 ; also sheet 4
33-2: R444.1 ; also sheet 4
34-2: R450.1 ; also sheet 4
35-2: R462.1 ; also sheet 4
36-2: R456.1 ; also sheet 4
37-2: R468.1 ; also sheet 4
38-2: R474.1 ; also sheet 4
39-2: R480.1 ; also sheet 4
40-2: R486.1 R492.1 ; also sheet 4
C1-6: C87.2 R423.2 U$76.24(C1)
C2-6: C86.2 R417.2 U$76.P$22(C2)
C3-6: C88.2 R429.2 U$76.P$20(C3)
C4-6: C89.2 R435.2 U$76.P$18(C4)
C5-6: C90.2 R441.2 U$76.P$16(C5)
C6-6: C91.2 R447.2 U$76.P$14(C6)
C7-6: C93.2 R459.2 U$76.P$12(C7)
C8-6: C92.2 R453.2 U$76.P$10(C8)
C9-6: C94.2 R465.2 U$76.P$8(C9)
C10-6: C95.2 R471.2 U$76.P$6(C10)
C11-6: C96.2 R477.2 U$76.P$4(C11)
C12-6: C97.2 R483.2 U$76.P$2(C12)
CSBI: U$77.5(A3) ; also sheet 1,2,3,4,5,7,8,9
GND: U$77.2(GND1) U$77.8(GND2) ; also sheet 1,2,3,4,5,7,8,9
GND6: C86.1 C87.1 C88.1 C89.1 C90.1 C91.1 C92.1 C93.1 C94.1 C95.1 C96.1 C97.1 C98.1 C99.1 C100.1 C101.1 C102.1 D88.A R489.2 R495.1 U$76.27(V-) U$76.28(NC) U$76.33(TOS) U$76.38(A1) U$76.40(A3) U$77.9(GND4) U$77.15(GND3)
N$342: R418.1 U$78.1(G)
N$343: R416.2 R419.2 U$78.3(D)
N$344: D76.A D77.C D88.C R416.1 R419.1 R421.2 R423.1 U$79.2(S)
N$345: R420.2 R498.1
N$346: R424.1 U$79.1(G)
N$347: R422.2 R425.2 U$79.3(D)
N$348: R421.1 R426.2
N$349: R430.1 U$80.1(G)
N$350: R428.2 R431.2 U$80.3(D)
N$351: D76.C D78.A R417.1 R428.1 R431.1 R498.2 U$78.2(S)
N$352: R427.1 R432.2
N$353: R436.1 U$81.1(G)
N$354: R434.2 R437.2 U$81.3(D)
N$355: D78.C D79.A R427.2 R429.1 R434.1 R437.1 U$80.2(S)
N$356: R433.1 R438.2
N$357: R442.1 U$82.1(G)
N$358: R440.2 R443.2 U$82.3(D)
N$359: D79.C D80.A R433.2 R435.1 R440.1 R443.1 U$81.2(S)
N$360: R439.1 R444.2
N$361: R448.1 U$83.1(G)
N$362: R446.2 R449.2 U$83.3(D)
N$363: D80.C D81.A R439.2 R441.1 R446.1 R449.1 U$82.2(S)
N$364: R445.1 R450.2
N$365: R454.1 U$84.1(G)
N$366: R452.2 R455.2 U$84.3(D)
N$367: D82.A D83.C R452.1 R455.1 R457.2 R459.1 U$85.2(S)
N$368: R451.1 R456.2
N$369: R460.1 U$85.1(G)
N$370: R458.2 R461.2 U$85.3(D)
N$371: D81.C D83.A R445.2 R447.1 R458.1 R461.1 U$83.2(S)
N$372: R457.1 R462.2
N$373: R466.1 U$86.1(G)
N$374: R464.2 R467.2 U$86.3(D)
N$375: D82.C D84.A R451.2 R453.1 R464.1 R467.1 U$84.2(S)
N$376: R463.1 R468.2
N$377: R472.1 U$87.1(G)
N$378: R470.2 R473.2 U$87.3(D)
N$379: D84.C D85.A R463.2 R465.1 R470.1 R473.1 U$86.2(S)
N$380: R469.1 R474.2
N$381: R478.1 U$88.1(G)
N$382: R476.2 R479.2 U$88.3(D)
N$383: D85.C D86.A R469.2 R471.1 R476.1 R479.1 U$87.2(S)
N$384: R475.1 R480.2
N$385: D87.C R481.2 R483.1 U$89.2(S)
N$386: R484.1 U$89.1(G)
N$387: R482.2 R485.2 U$89.3(D)
N$388: D86.C D87.A D89.A R475.2 R477.1 R482.1 R485.1 U$88.2(S)
N$389: R481.1 R486.2
N$390: R487.1 R488.2
N$391: R488.1 R490.1 U$90.1
N$392: D77.A R422.1 R425.1 R487.2
N$393: R489.1 R490.2
N$394: R491.1 R492.2
N$395: D89.C R491.2 R493.1 R494.1
N$396: C100.2 R495.2 U$76.26(CO)
N$397: C101.2 U$76.31(VREFF)
N$398: C102.2 R496.1 R497.1 U$76.32(VREG) U$76.37(A0) U$76.39(A2) U$77.10(EN2) U$77.16(VDD2)
N$399: R496.2 U$76.34(WDTB)
N$400: R497.2 U$76.43(SDO) U$77.11(B4)
N$401: U$76.44(CSBI) U$77.12(B3)
N$402: U$76.42(SDI) U$77.13(B2)
N$403: U$76.41(SCKI) U$77.14(B1)
N$404: D90.C U$77.6(A4)
S1-6: R424.2 U$76.25(S1)
S2-6: R418.2 U$76.23(S2)
S3-6: R430.2 U$76.P$21(S3)
S4-6: R436.2 U$76.P$19(S4)
S5-6: R442.2 U$76.P$17(S5)
S6-6: R448.2 U$76.P$15(S6)
S7-6: R460.2 U$76.P$13(S7)
S8-6: R454.2 U$76.P$11(S8)
S9-6: R466.2 U$76.P$9(S9)
S10-6: R472.2 U$76.P$7(S10)
S11-6: R478.2 U$76.P$5(S11)
S12-6: R484.2 U$76.P$3(S12)
SCK: U$77.3(A1) ; also sheet 1,2,3,4,5,7,8,9
SDI: U$77.4(A2) ; also sheet 1,2,3,4,5,7,8,9
SDO: D90.A ; also sheet 1,2,3,4,5,7,8,9
V1+6: C98.2 C99.2 R493.2 R494.2 U$76.P$1(V+)
VDD: U$77.1(VDD1) U$77.7(EN1) ; also sheet 1,2,3,4,5,7,8,9
Unconnected: U$76.29(VTEMP1) U$76.30(VTEMP2) U$76.35(GPIO1) U$76.36(GPIO2)

### Notes on the sheet
- Module 6 [85]